# EAGLE design os23dc (EAGLE 7.3.0)
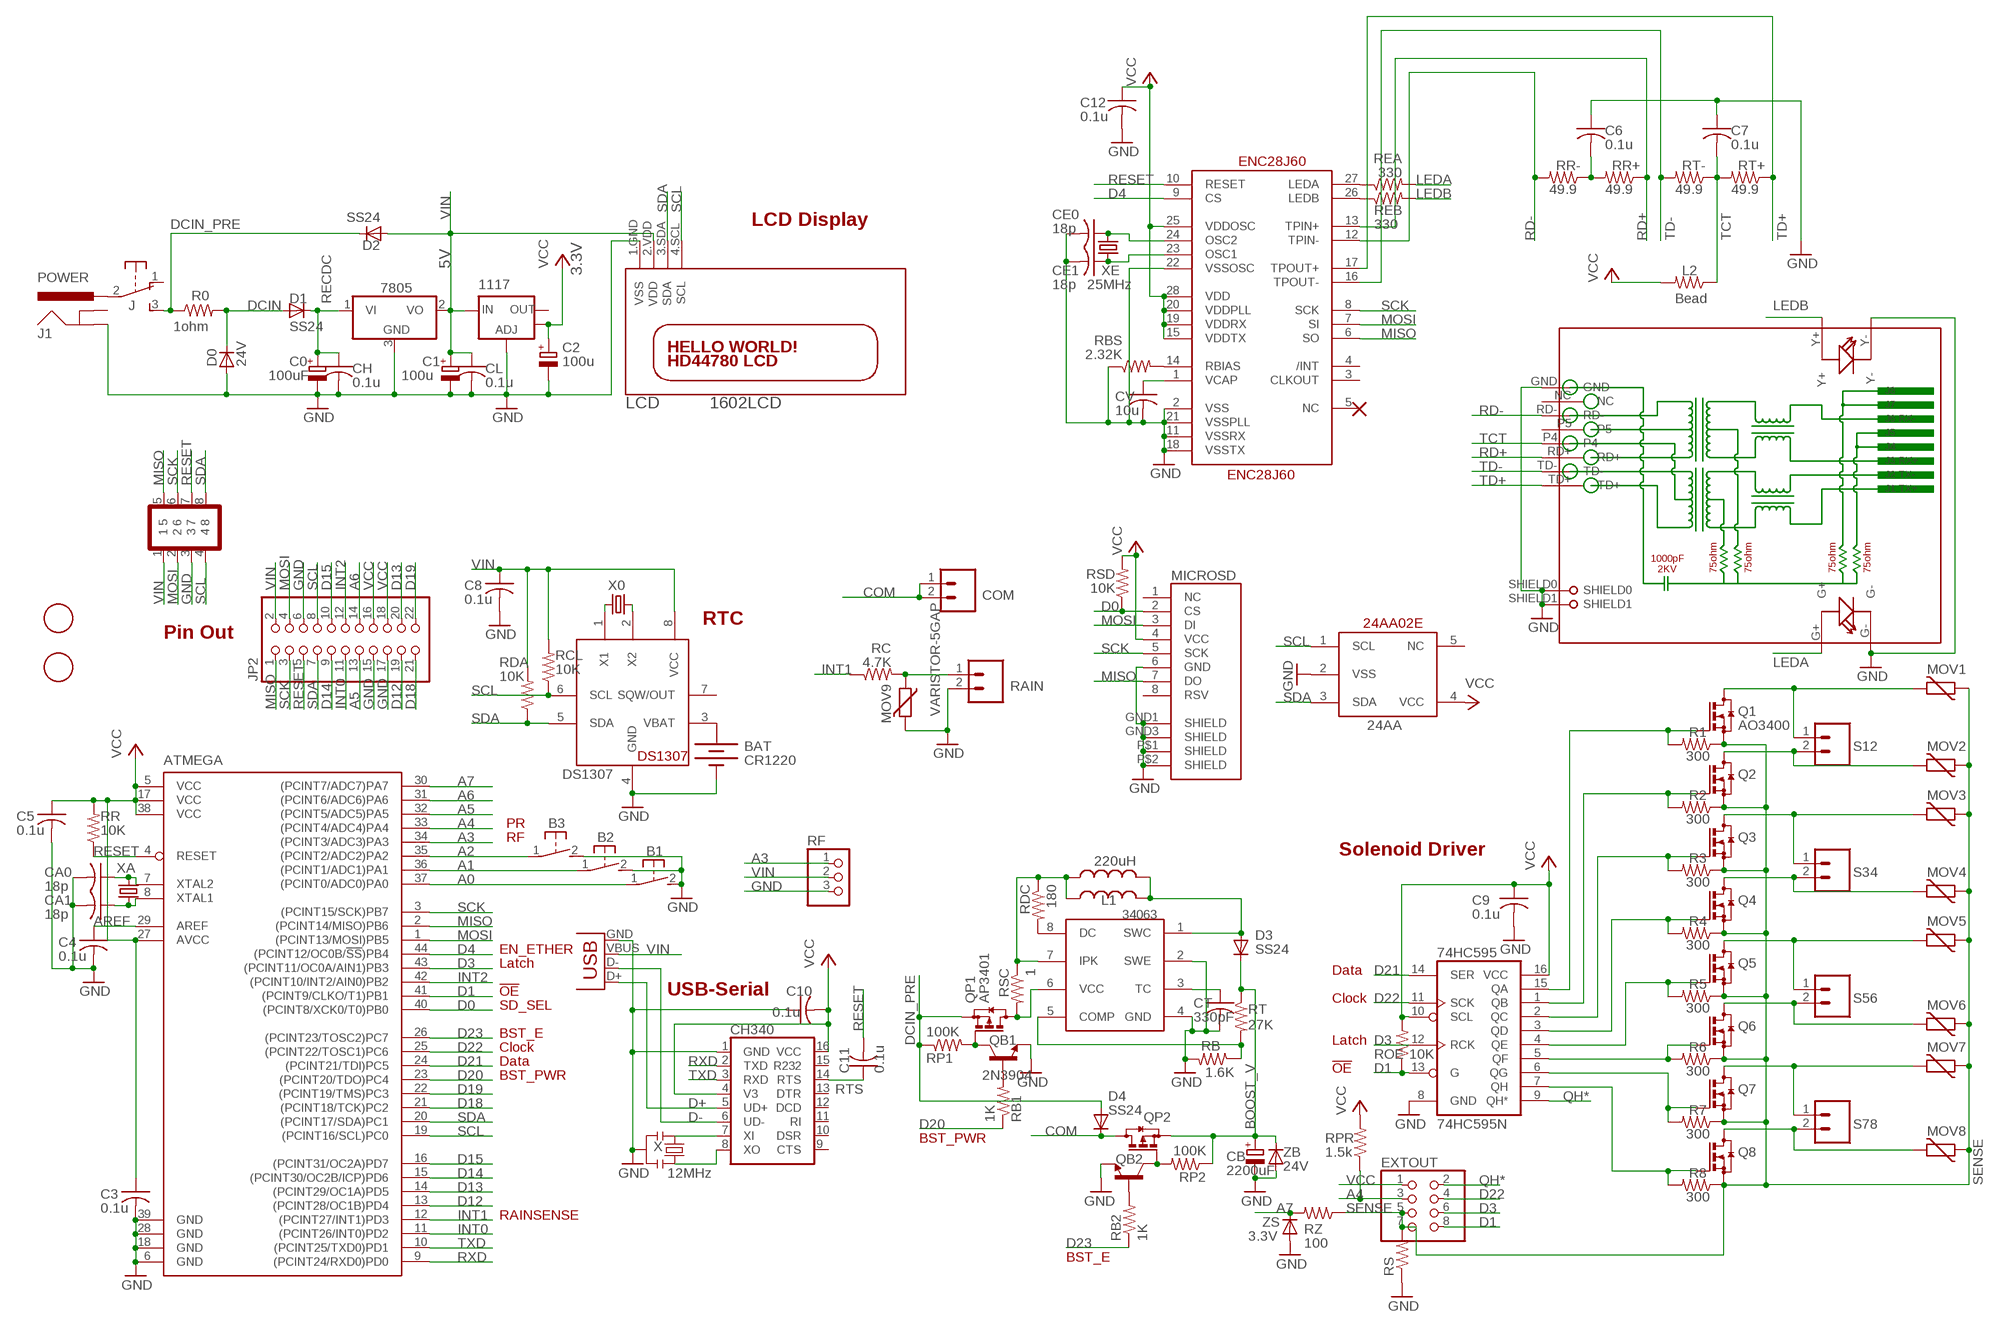
[diagram p0: schematic, sheet 1]

## Parts
24AA  24AA02E48  [SOT23-5L]
74HC595  74HC595N  74LS595D  [SO16]
1117  V_REG_LM1117SOT223  [SOT223]
7805  7805DT  [TO252]
34063  MC33063/MC34063D  [SO08]
ATMEGA  ATMEGA644A  [TQFP44]
B1  31-XX  [B3F-31XX]
B2  31-XX  [B3F-31XX]
B3  31-XX  [B3F-31XX]
BAT  CR1220  BATTERYBATTERY_12MM_SMT  [BATTCON_12MM_SMT]
C0  100uF  CPOL-EUE  [PANASONIC_E]
C1  100u  CPOL-EUD  [PANASONIC_D]
C2  100u  CPOL-EUD  [PANASONIC_D]
C3  0.1u  C-USC0603K  [C0603K]
C4  0.1u  C-USC0603  [C0603]
C5  0.1u  C-USC0603  [C0603]
C6  0.1u  C-USC0603  [C0603]
C7  0.1u  C-USC0603K  [C0603K]
C8  0.1u  C-USC0603  [C0603]
C9  0.1u  C-USC0603  [C0603]
C10  0.1u  C-USC0603  [C0603]
C11  0.1u  C-USC0603  [C0603]
C12  0.1u  C-USC0603  [C0603]
CA0  18p  C-USC0603K  [C0603K]
CA1  18p  C-USC0603K  [C0603K]
CB  2200uF  CPOL-EUE7.5-16  [E7,5-16]
CE0  18p  C-USC0603K  [C0603K]
CE1  18p  C-USC0603K  [C0603K]
CH  0.1u  C-USC0603  [C0603]
CH340  CH340G  [SO16]
CL  0.1u  C-USC0603  [C0603]
COM  M025MM-X  [SCREWTERMINAL-5MM-2-X]
CT  330pF  C-USC0603K  [C0603K]
CV  10u  C-USC0805K  [C0805K]
D0  24V  DIODE-MINIMELF  [MINIMELF]
D1  SS24  DIODE-DO-214AC  [DO-214AC]
D2  SS24  DIODE-DO-214AC  [DO-214AC]
D3  SS24  DIODE-DO-214AC  [DO-214AC]
D4  SS24  DIODE-DO-214AC  [DO-214AC]
DS1307  DS1307  DS1307SOIC  [SO08]
ENC28J60  ENC28J60  [SSOP28DB]
EXTOUT  PINHD-2X4  [2X04]
J  EG1206  [EG1206]
J1  POWER  POWER_JACKPTH_LOCK  [POWER_JACK_PTH_LOCK]
JP2  PINHD-2X11  [2X11]
L1  INDUCTORCR54  [CR54]
L1'  220uH  L-US0204/5  [0204/5]
L2  Bead  R-US_R0805  [R0805]
LCD  1602LCD  HD44780LCD-I2CSIDE  [LCD1602-I2C-SIDE]
MICROSD  USD-SOCKETMICRO-SD-SOCKET-TAOBAO  [MICRO-SD-SOCKET-TAOBAO]
MOV1  7D270K  VARISTOR-5GAP  [R-5GAP]
MOV2  7D270K  VARISTOR-5GAP  [R-5GAP]
MOV3  7D270K  VARISTOR-5GAP  [R-5GAP]
MOV4  7D270K  VARISTOR-5GAP  [R-5GAP]
MOV5  7D270K  VARISTOR-5GAP  [R-5GAP]
MOV6  7D270K  VARISTOR-5GAP  [R-5GAP]
MOV7  7D270K  VARISTOR-5GAP  [R-5GAP]
MOV8  7D270K  VARISTOR-5GAP  [R-5GAP]
MOV9  VARISTOR-5GAP  [R-5GAP]
Q1  AO3400  BSS123  [SOT23]
Q2  BSS123  [SOT23]
Q3  BSS123  [SOT23]
Q4  BSS123  [SOT23]
Q5  BSS123  [SOT23]
Q6  BSS123  [SOT23]
Q7  BSS123  [SOT23]
Q8  BSS123  [SOT23]
QB1  2N3904  TRANSISTOR_NPNSOT23-3  [SOT23-3]
QB2  TRANSISTOR_NPNSOT23-3  [SOT23-3]
QP1  AP3401  BSS84  [SOT23]
QP2  BSS84  [SOT23]
R0  1ohm  R-US_R2010  [R2010]
R1  300  R-US_R0603  [R0603]
R2  300  R-US_R0603  [R0603]
R3  300  R-US_R0603  [R0603]
R4  300  R-US_R0603  [R0603]
R5  300  R-US_R0603  [R0603]
R6  300  R-US_R0603  [R0603]
R7  300  R-US_R0603  [R0603]
R8  300  R-US_R0603  [R0603]
RAIN  M025MM-X  [SCREWTERMINAL-5MM-2-X]
RB  1.6K  R-US_R0603  [R0603]
RB1  1K  R-US_R0603  [R0603]
RB2  1K  R-US_R0603  [R0603]
RBS  2.32K  R-US_R0805  [R0805]
RC  4.7K  R-US_R0805  [R0805]
RCL  10K  R-US_R0603  [R0603]
RDA  10K  R-US_R0603  [R0603]
RDC  180  R-US_R0603  [R0603]
REA  330  R-US_R0603  [R0603]
REB  330  R-US_R0603  [R0603]
RF  PINHD-1X3  [1X03]
RJ45  HR911105A  [HR911105A]
ROE  10K  R-US_R0603  [R0603]
RP1  100K  R-US_R0603  [R0603]
RP2  100K  R-US_R0603  [R0603]
RPR  1.5k  R-US_R0603  [R0603]
RR  10K  R-US_R0603  [R0603]
RR+  49.9  R-US_R0603  [R0603]
RR-  49.9  R-US_R0603  [R0603]
RS  R-US_R2512  [R2512]
RSC  1  R-US_R0603  [R0603]
RSD  10K  R-US_R0603  [R0603]
RT  27K  R-US_R0603  [R0603]
RT+  49.9  R-US_R0603  [R0603]
RT-  49.9  R-US_R0603  [R0603]
RZ  100  R-US_R0402  [R0402]
S12  M025MM-X  [SCREWTERMINAL-5MM-2-X]
S34  M025MM-X  [SCREWTERMINAL-5MM-2-X]
S56  M025MM-X  [SCREWTERMINAL-5MM-2-X]
S78  M025MM-X  [SCREWTERMINAL-5MM-2-X]
U$1  FIDUCIAL  [FIDUCIAL_1MM]
U$3  FIDUCIAL  [FIDUCIAL_1MM]
U$4  GOLDFINGER_2X4  [GOLDFINGER_2X4]
USB  USBPTH  [USB-B-PTH]
X  12MHz  RESONATORSMD  [RESONATOR-SMD]
X0  32.768kHz  CRYSTALMM20SS  [MM20SS]
XA  12MHz  CRYSTAL4SMD  [4SMD]
XE  25MHz  CRYSTAL4SMD  [4SMD]
ZB  24V  DIODE-MINIMELF  [MINIMELF]
ZS  3.3V  DIODE-MINIMELF  [MINIMELF]

## Nets
A0: ATMEGA.37((PCINT0/ADC0)PA0) B1.1(P)
A1: ATMEGA.36((PCINT1/ADC1)PA1) B2.1(P)
A2: ATMEGA.35((PCINT2/ADC2)PA2) B3.1(P)
A3: ATMEGA.34((PCINT3/ADC3)PA3) RF.1
A4: ATMEGA.33((PCINT4/ADC4)PA4) EXTOUT.3 RPR.1
A5: ATMEGA.32((PCINT5/ADC5)PA5) JP2.13
A6: ATMEGA.31((PCINT6/ADC6)PA6) JP2.14
A7: ATMEGA.30((PCINT7/ADC7)PA7) RZ.2 ZS.C
AREF: ATMEGA.29(AREF) C4.1
BOOST_V: CB.+ D3.C QP2.2(S) RP2.1 RT.1 ZB.C
COM: COM.1 COM.2 D4.C QP2.3(D)
D0: ATMEGA.40((PCINT8/XCK0/T0)PB0) MICROSD.2(CS) RSD.1
D1: 74HC595.13(G) ATMEGA.41((PCINT9/CLKO/T1)PB1) EXTOUT.8 ROE.1
D3: 74HC595.12(RCK) ATMEGA.43((PCINT11/OC0A/AIN1)PB3) EXTOUT.6
D4: ATMEGA.44((PCINT12/OC0B/!SS!)PB4) ENC28J60.9(CS)
D12: ATMEGA.13((PCINT28/OC1B)PD4) JP2.19
D13: ATMEGA.14((PCINT29/OC1A)PD5) JP2.20
D14: ATMEGA.15((PCINT30/OC2B/ICP)PD6) JP2.9
D15: ATMEGA.16((PCINT31/OC2A)PD7) JP2.10
D18: ATMEGA.21((PCINT18/TCK)PC2) JP2.21
D19: ATMEGA.22((PCINT19/TMS)PC3) JP2.22
D20: ATMEGA.23((PCINT20/TDO)PC4) RB1.1
D21: 74HC595.14(SER) ATMEGA.24((PCINT21/TDI)PC5)
D22: 74HC595.11(SCK) ATMEGA.25((PCINT22/TOSC1)PC6) EXTOUT.4
D23: ATMEGA.26((PCINT23/TOSC2)PC7) RB2.1
D+: CH340.5(UD+) USB.D+
D-: CH340.6(UD-) USB.D-
DCIN [power]: D0.C D1.A R0.2
DCIN_PRE [power]: D2.C D4.A J.3(S) QP1.2(S) R0.1 RP1.1
GND: 24AA.2(VSS) 74HC595.8(GND) 1117.1(ADJ) 7805.3(GND) 34063.2(SWE) 34063.4(GND) ATMEGA.6(GND) ATMEGA.18(GND) ATMEGA.28(GND) ATMEGA.39(GND) B1.2(S) B2.2(S) B3.2(S) BAT.P$1(-) C0.- C1.- C2.- C3.2 C4.2 C5.2 C6.1 C7.1 C8.2 C9.2 C10.1 C12.2 CA0.2 CA1.2 CB.- CE0.2 CE1.2 CH340.1(GND) CH.2 CL.2 CT.2 CV.2 D0.A DS1307.4(GND) ENC28J60.2(VSS) ENC28J60.11(VSSRX) ENC28J60.18(VSSTX) ENC28J60.21(VSSPLL) ENC28J60.22(VSSOSC) J1.GND JP2.6 JP2.15 JP2.17 LCD.1.GND(VSS) MICROSD.6(GND) MICROSD.GND1(SHIELD) MICROSD.GND3(SHIELD) MICROSD.P$1(SHIELD) MICROSD.P$2(SHIELD) MOV9.2 QB1.2(E) QB2.2(E) RAIN.2 RB.2 RBS.1 RF.3 RJ45.G- RJ45.GND RJ45.SHIELD0 RJ45.SHIELD1 RJ45.Y- RS.1 U$4.3 USB.GND X.2 ZB.A ZS.A
INT0: ATMEGA.11((PCINT26/INT0)PD2) JP2.11
INT1: ATMEGA.12((PCINT27/INT1)PD3) RC.1
INT2: ATMEGA.42((PCINT10/INT2/AIN0)PB2) JP2.12
LEDA: REA.2 RJ45.G+
LEDB: REB.2 RJ45.Y+
MISO: ATMEGA.2((PCINT14/MISO)PB6) ENC28J60.6(SO) JP2.1 MICROSD.7(DO) U$4.5
MOSI: ATMEGA.1((PCINT13/MOSI)PB5) ENC28J60.7(SI) JP2.4 MICROSD.3(DI) U$4.2
N$1: J1.PWR J.2(P)
N$2: QB1.3(C) QP1.1(G) RP1.2
N$3: MOV9.1 RAIN.1 RC.2
N$4: 74HC595.5(QF) Q6.1(G) R6.2
N$5: 74HC595.6(QG) Q7.1(G) R7.2
N$6: CH340.7(XI) X.1
N$7: 74HC595.7(QH) Q8.1(G) R8.2
N$8: DS1307.1(X1) X0.1
N$9: 34063.1(SWC) D3.A L1'.2 L1.P$2
N$10: 74HC595.4(QE) Q5.1(G) R5.2
N$11: 74HC595.3(QD) Q4.1(G) R4.2
N$12: 74HC595.2(QC) Q3.1(G) R3.2
N$13: 74HC595.1(QB) Q2.1(G) R2.2
N$14: 74HC595.15(QA) Q1.1(G) R1.2
N$15: ATMEGA.7(XTAL2) CA0.1 XA.1
N$16 [power]: MOV1.2 Q1.3(D) S12.1
N$17 [power]: MOV2.2 Q2.3(D) S12.2
N$18 [power]: MOV3.2 Q3.3(D) S34.1
N$19: ATMEGA.8(XTAL1) CA1.1 XA.3
N$20 [power]: MOV4.2 Q4.3(D) S34.2
N$22 [power]: MOV5.2 Q5.3(D) S56.1
N$23 [power]: MOV6.2 Q6.3(D) S56.2
N$24 [power]: MOV7.2 Q7.3(D) S78.1
N$25 [power]: MOV8.2 Q8.3(D) S78.2
N$26: 34063.7(IPK) L1'.1 L1.P$1 RDC.1 RSC.1
N$27: 34063.6(VCC) QP1.3(D) RSC.2
N$28: 34063.3(TC) CT.1
N$29: 34063.5(COMP) RB.1 RT.2
N$30: DS1307.2(X2) X0.4
N$31: 34063.8(DC) RDC.2
N$32: QB1.1(B) RB1.2
N$34: ENC28J60.27(LEDA) REA.1
N$36: BAT.P$2(+) DS1307.3(VBAT)
N$37: ENC28J60.26(LEDB) REB.1
N$38: QB2.3(C) QP2.1(G) RP2.2
N$39: CV.1 ENC28J60.1(VCAP)
N$40: CH340.8(XO) X.3
N$41: CE0.1 ENC28J60.24(OSC2) XE.3
N$42: CE1.1 ENC28J60.23(OSC1) XE.1
N$43: QB2.1(B) RB2.2
N$54: C6.2 RR+.2 RR-.1
N$59: ENC28J60.14(RBIAS) RBS.2
QH*: 74HC595.9(QH*) EXTOUT.2
RD+: ENC28J60.13(TPIN+) RJ45.RD+ RR+.1
RD-: ENC28J60.12(TPIN-) RJ45.RD- RR-.2
RECDC [power]: 7805.1(VI) C0.+ CH.1 D1.C
RESET: ATMEGA.4(RESET) C11.2 ENC28J60.10(RESET) JP2.5 RR.1 U$4.7
RTS: C11.1 CH340.14(RTS)
RXD: ATMEGA.9((PCINT24/RXD0)PD0) CH340.2(TXD)
SCK: ATMEGA.3((PCINT15/SCK)PB7) ENC28J60.8(SCK) JP2.3 MICROSD.5(SCK) U$4.6
SCL: 24AA.1(SCL) ATMEGA.19((PCINT16/SCL)PC0) DS1307.6(SCL) JP2.8 LCD.4.SCL(SCL) RCL.1 U$4.4
SDA: 24AA.3(SDA) ATMEGA.20((PCINT17/SDA)PC1) DS1307.5(SDA) JP2.7 LCD.3.SDA(SDA) RDA.1 U$4.8
SENSE [power]: EXTOUT.5 EXTOUT.7 MOV1.1 MOV2.1 MOV3.1 MOV4.1 MOV5.1 MOV6.1 MOV7.1 MOV8.1 Q1.2(S) Q2.2(S) Q3.2(S) Q4.2(S) Q5.2(S) Q6.2(S) Q7.2(S) Q8.2(S) R1.1 R2.1 R3.1 R4.1 R5.1 R6.1 R7.1 R8.1 RS.2 RZ.1
TCT: C7.2 L2.1 RJ45.P4 RT+.2 RT-.1
TD+: ENC28J60.17(TPOUT+) RJ45.TD+ RT+.1
TD-: ENC28J60.16(TPOUT-) RJ45.TD- RT-.2
TXD: ATMEGA.10((PCINT25/TXD0)PD1) CH340.3(RXD)
VCC: 24AA.4(VCC) 74HC595.10(SCL) 74HC595.16(VCC) 1117.4(OUT) ATMEGA.5(VCC) ATMEGA.17(VCC) ATMEGA.27(AVCC) ATMEGA.38(VCC) C2.+ C3.1 C5.1 C9.1 C10.2 C12.1 CH340.4(V3) CH340.16(VCC) ENC28J60.15(VDDTX) ENC28J60.19(VDDRX) ENC28J60.20(VDDPLL) ENC28J60.25(VDDOSC) ENC28J60.28(VDD) EXTOUT.1 JP2.16 JP2.18 L2.2 MICROSD.4(VCC) ROE.2 RPR.2 RR.2 RSD.2
VIN [power]: 1117.3(IN) 7805.2(VO) C1.+ C8.1 CL.1 D2.A DS1307.8(VCC) JP2.2 LCD.2.VDD(VDD) RCL.2 RDA.2 RF.2 U$4.1 USB.VBUS
Unconnected: 24AA.5(NC) 1117.2(OUT) CH340.9(CTS) CH340.10(DSR) CH340.11(RI) CH340.12(DCD) CH340.13(DTR) CH340.15(R232) DS1307.7(SQW/OUT) ENC28J60.3(CLKOUT) ENC28J60.4(/INT) ENC28J60.5(NC) J1.GNDBREAK J.1(O) MICROSD.1(NC) MICROSD.8(RSV) RJ45.NC RJ45.P5

## Notes on the sheet
- LCD Display
- 5V
- 3.3V
- RTC
- Pin Out
- PR
- RF
- Solenoid Driver
- EN_ETHER
- Latch
- Data
- !OE | USB-Serial
- Clock
- SD_SEL
- BST_E
- Latch
- Clock
- Data
- !OE
- BST_PWR
- BST_PWR
- RAINSENSE
- BST_E

## Library data of the parts
24AA = adafruit:24AA02E48
74HC595 = SparkFun:74*595: 8-bit SHIFT REGISTER, output latch
1117 = SparkFun:V_REG_LM1117: Voltage Regulator LM1117 Standard adjustable voltage regulator but in SMD form. Spark Fun Electronics SKU : COM-00595
7805 = linear:78*: Positive VOLTAGE REGULATOR Source: http://cache.national.com/ds/LM/LM78L05.pdf http://www.fairchildsemi.com/ds/LM/LM7805.pdf
34063 = adafruit:MC33063/MC34063: MC33063 and MC34063 Basic DC/DC converter with internal power-NPN transistor, 100KHz, 1.5A peak switch current. 3-40 input/output.
ATMEGA = atmel:ATMEGA644: 8-bit Microcontroller with 64K Bytes In-System Programmable Flash Source: http://www.atmel.com/dyn/resources/prod_documents/doc2593.pdf; MPN: ATMEGA644PV-10AU; OC_FARNELL: 1455123; OC_NEWARK: 58M3748
B1-B3 = adafruit:31-XX: OMRON SWITCH Now with beefier pads!
BAT = SparkFunNew:BATTERY: Battery Holders Various common sizes : AA, AAA, 20mm coin cell and 12mm coin cell.
C0 C1 C2 = resistor:CPOL-EU: POLARIZED CAPACITOR, European symbol
C3-C12 CA0 CA1 CE0 CE1 CH CL CT CV = adafruit:C-US: CAPACITOR, American symbol
CB = rcl:CPOL-EU: POLARIZED CAPACITOR, European symbol
CH340 = SparkFunNew:CH340
COM RAIN S12 S34 S56 S78 = SparkFun:M02: Header 2 Standard 2-pin 0.1" header. Use with straight break away headers (SKU : PRT-00116), right angle break away headers (PRT-00553), swiss pins (PRT-00743), machine pins (PRT-00117), and female headers (PRT-00115). Molex polarized connector foot print use with SKU : PRT-08233 with associated crimp pins and housings.
D0 D1-D4 ZB ZS = diode:DIODE-: DIODE
DS1307 = adafruit:DS1307: DS1307 Real time clock (RTC) with battery backup ability. Talk to it via i2c
ENC28J60 = SparkFun:ENC28J60
EXTOUT = pinhead:PINHD-2X4: PIN HEADER
J = adafruit:EG1206
J1 = SparkFunNew:POWER_JACK: Power Jack This is the standard 5.5mm barrel jack for power. The PTH is the most common, proven, reliable, footprint. All others are experimental. The Slot footprint only works if the mill layer is transmitted to the PCB fab house so be warned. Spark Fun Electronics SKU : PRT-00119. Mating wall wart : TOL-00298 (and others)
JP2 = pinhead:PINHD-2X11: PIN HEADER
L1 = SparkFunNew:INDUCTOR: Inductors Basic Inductor/Choke - 0603 and 1206. Footprints are not proven and vary greatly between part numbers.
L1' = rcl:L-US: INDUCTOR, American symbol
L2 R1-R8 RC RCL RDA ROE RPR RR RS RSD = adafruit2013:R-US_: RESISTOR, American symbol
LCD = adafruit:HD44780LCD-I2C
MICROSD = SparkFunNew:USD-SOCKET: microSD Socket Push-push type uSD socket. Schematic element and footprint production proven. Spark Fun Electronics SKU : PRT-00127. tDoc lines correctly indicate media card edge positions when inserting (unlocked, locked, depressed).
MOV1-MOV9 = varistor:VARISTOR: VARISTOR
Q1-Q8 = transistor-small-signal:BSS123: N-CHANNEL MOS FET
QB1 QB2 = SparkFunNew:TRANSISTOR_NPN: Transistor NPN BJT configuration in SOT23 package. MMBT2222 is the common NPN we use. Double check BCE configuration again layout.
QP1 QP2 = transistor-small-signal:BSS84: P-CHANNEL MOS FET
R0 RB RB1 RB2 RBS RDC REA REB RP1 RP2 RR+ RR- RSC RT RT+ RT- RZ = adafruitGood:R-US_: RESISTOR, American symbol
RF = pinhead:PINHD-1X3: PIN HEADER
RJ45 = CONNECTER:HR911105A
U$1 U$3 = adafruitGood:FIDUCIAL: For use by pick and place machines to calibrate the vision/machine, 1mm By microbuilder.eu
U$4 = SparkFunNew:GOLDFINGER_2X4
USB = SparkFunNew:USB: USB Connectors USB-B-PTH is fully proven SKU : PRT-00139 USB-miniB is fully proven SKU : PRT-00587 USB-A-PCB is untested. USB-A-H is throughly reviewed, but untested. Spark Fun Electronics SKU : PRT-00437 USB-B-SMT is throughly reviewed, but untested. Needs silkscreen touching up. USB-A-S has not been used/tested USB-MB-H has not been used/tested
X = SparkFunNew:RESONATOR: Resonator Small SMD resonator. This is the itty bitty 10/20MHz resonators with built in caps. CSTCE10M0G55 and CSTCE20M0V53. Footprint has been reviewed closely but hasn't been tested yet.
X0 = crystal:CRYSTAL: CRYSTAL; OC_FARNELL: unknown; OC_NEWARK: unknown
XA XE = adafruit_3:CRYSTAL: CRYSTAL

## Net classes
0 default: width 0.203 mm, clearance 0.178 mm
1 power: width 0.305 mm, clearance 0.178 mm
2 relaypower: width 0.813 mm, clearance 0.305 mm

## Board
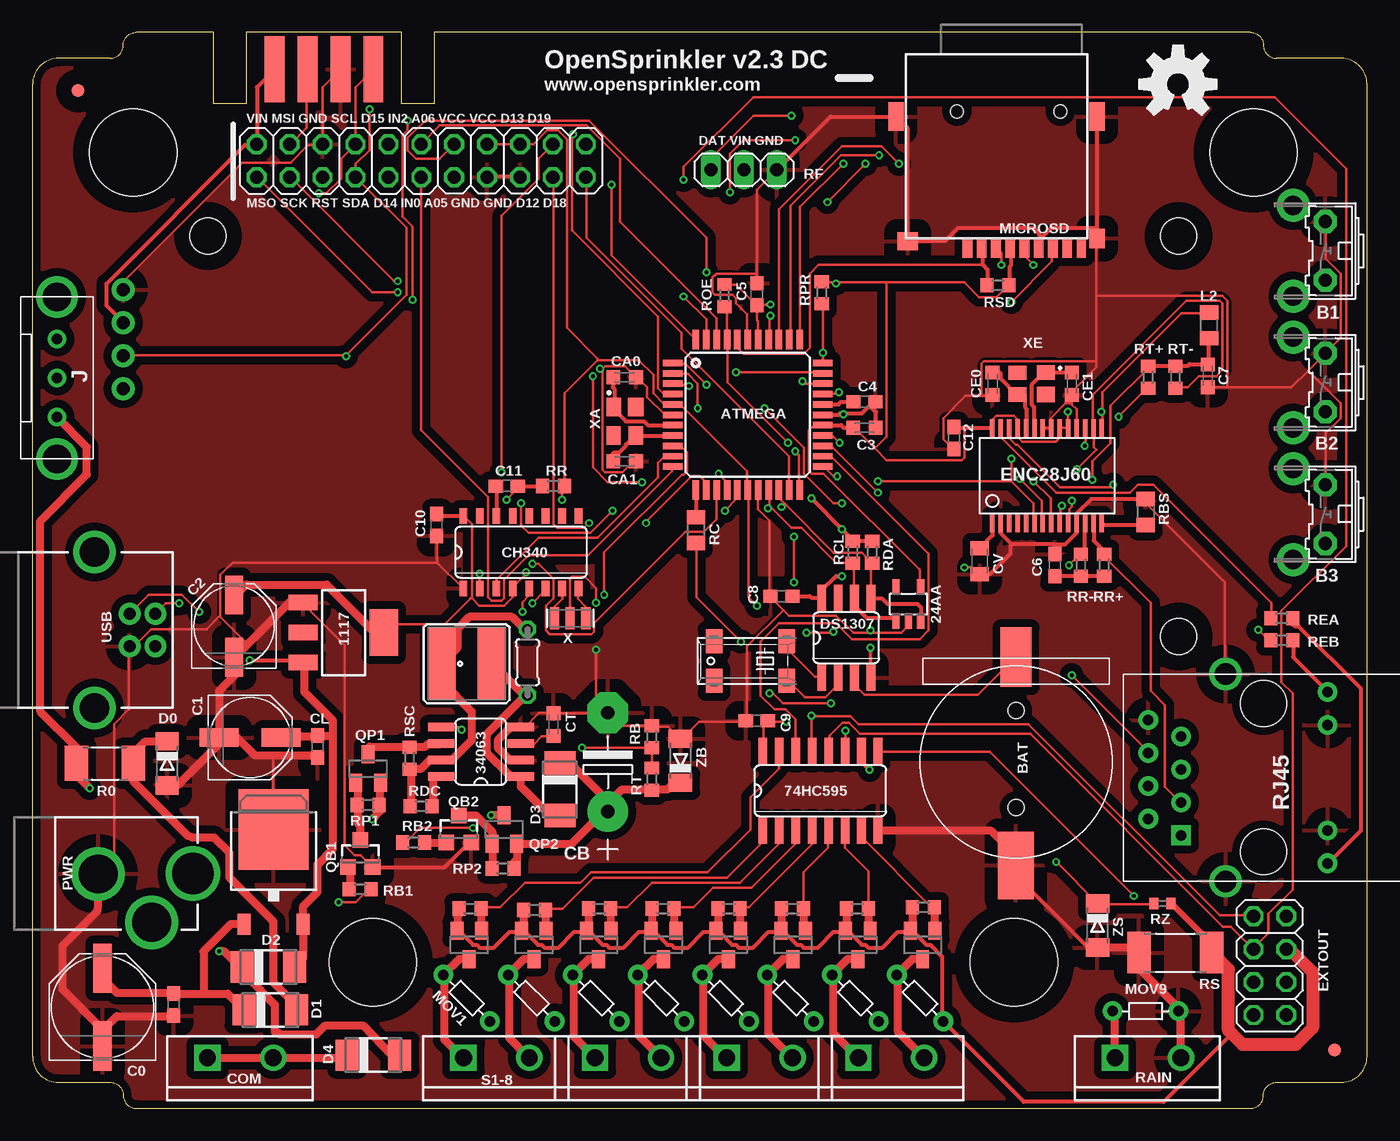
[diagram p1: board, top side]
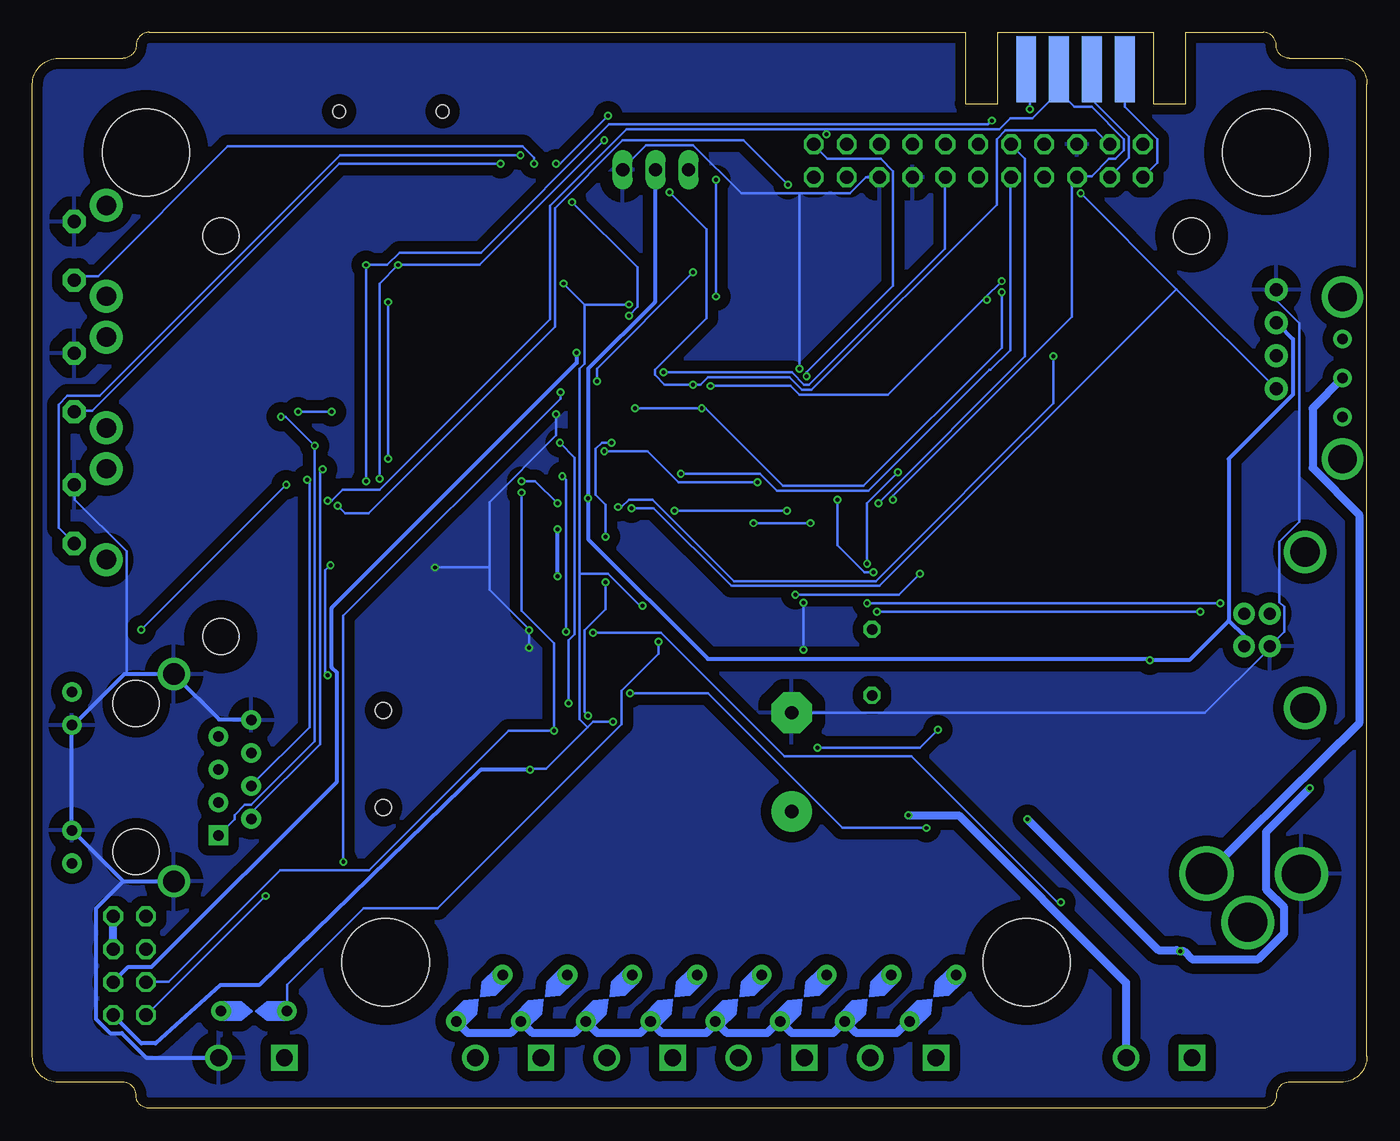
[diagram p2: board, bottom side, seen from below]

Size 103 x 83 mm. Coordinates in mm from the lower left corner, seen from the top.
Outline: 101,81 96,81 arc-90 95,82 arc90 94,83 31,83 31,77.5 28.5,77.5 28.5,83 16.5,83 16.5,77.5 14,77.5 14,83 8,83 arc90 7,82 arc-90 6,81 2,81 arc90 0,79 0,4 arc90 2,2 6,2 arc-90 7,1 arc90 8,0 94,0 arc90 95,1 arc-90 96,2 101,2 arc90 103,4 103,79 arc90 101,81
Copper layers (1*16): Top 0.035mm / dielectric 1.5mm / Bottom 0.035mm
Design rules "Fusion_eagle_rule_v1.1 *": minimum track width 6mil, minimum drill 12mil, track to track 6mil, track to pad 6mil, pad to pad 6mil, via to via 6mil, smd to smd 0mil, copper to edge 10mil, drill to drill 10mil, minimum pad ring 10mil, minimum via ring 6mil, stop-mask expansion 2mil, vias tented up to drill 100mil, thermal gap 40mil
Holes 6.75 mm at 7.76,73.74 94.24,73.74 26.26,11.26 75.74,11.26
tRestrict: area 3.8,69.7 to 11.8,77.7; area 90.2,69.7 to 98.2,77.7; area 22.3,7.3 to 30.3,15.3; area 71.7,7.3 to 79.7,15.3
bRestrict: area 3.8,69.7 to 11.8,77.7; area 90.2,69.7 to 98.2,77.7; area 22.3,7.3 to 30.3,15.3; area 71.7,7.3 to 79.7,15.3

### Footprints (pad centres in the part's own frame; a part is rotated, then mirrored left to right if it is on the bottom)
SOT23-5L = smd 0.55 x 1.2: 1 -0.95,-1.3; 2 0,-1.3; 3 0.95,-1.3; 4 0.95,1.3; 5 -0.95,1.3
SO16 = smd 0.66 x 2.032: 1 -4.445,-3.073; 2 -3.175,-3.073; 3 -1.905,-3.073; 4 -0.635,-3.073; 5 0.635,-3.073; 6 1.905,-3.073; 7 3.175,-3.073; 8 4.445,-3.073; 9 4.445,3.073; 10 3.175,3.073; 11 1.905,3.073; 12 0.635,3.073; 13 -0.635,3.073; 14 -1.905,3.073; 15 -3.175,3.073; 16 -4.445,3.073
SOT223 = smd 1.219 x 2.235: 1 -2.311,-3.099; 2 0,-3.099; 3 2.311,-3.099 | smd 3.6 x 2.2: 4 0,3.099
TO252 = smd 1 x 1.6: 1 -2.28,-4.8; 2 2.28,-4.8 | smd 5.4 x 6.2: 3 0,2.5
SO08 = smd 0.66 x 2.032: 1 -1.905,-3.073; 2 -0.635,-3.073; 3 0.635,-3.073; 4 1.905,-3.073; 5 1.905,3.073; 6 0.635,3.073; 7 -0.635,3.073; 8 -1.905,3.073
TQFP44 = smd 1.5 x 0.5: 1 -5.8,4; 2 -5.8,3.2; 3 -5.8,2.4; 4 -5.8,1.6; 5 -5.8,0.8; 6 -5.8,0; 7 -5.8,-0.8; 8 -5.8,-1.6; 9 -5.8,-2.4; 10 -5.8,-3.2; 11 -5.8,-4; 23 5.8,-4; 24 5.8,-3.2; 25 5.8,-2.4; 26 5.8,-1.6; 27 5.8,-0.8; 28 5.8,0; 29 5.8,0.8; 30 5.8,1.6; 31 5.8,2.4; 32 5.8,3.2; 33 5.8,4 | smd 0.5 x 1.5: 12 -4,-5.8; 13 -3.2,-5.8; 14 -2.4,-5.8; 15 -1.6,-5.8; 16 -0.8,-5.8; 17 0,-5.8; 18 0.8,-5.8; 19 1.6,-5.8; 20 2.4,-5.8; 21 3.2,-5.8; 22 4,-5.8; 34 4,5.8; 35 3.2,5.8; 36 2.4,5.8; 37 1.6,5.8; 38 0.8,5.8; 39 0,5.8; 40 -0.8,5.8; 41 -1.6,5.8; 42 -2.4,5.8; 43 -3.2,5.8; 44 -4,5.8
B3F-31XX = drill 1.016 pad 1.778 octagon: 1 -2.261,-1.245; 2 2.261,-1.245 | drill 1.499 pad 2.54: 3 -3.505,1.245; 4 3.505,1.245
BATTCON_12MM_SMT = smd 2.8 x 5.2: P$1 0,11.96 | smd 2.4 x 4.6: P$2 0,-4.1 | hole 1.25: 0,7.5; 0,0
PANASONIC_E = smd 3.8 x 1.4: + 3,0; - -3,0
PANASONIC_D = smd 3 x 1.4: + 2.4,0; - -2.4,0
C0603K = smd 1.05 x 1.08: 1 -0.875,0; 2 0.875,0
C0603 = smd 1.1 x 1: 1 -0.85,0; 2 0.85,0
E7,5-16 = drill 1.016 pad 3.15: + -3.81,0 | drill 1.016 pad 3.15 octagon: - 3.81,0
SO16' = smd 0.6 x 1.2: 1 -4.445,-2.8; 2 -3.175,-2.8; 3 -1.905,-2.8; 4 -0.635,-2.8; 5 0.635,-2.8; 6 1.905,-2.8; 7 3.175,-2.8; 8 4.445,-2.8; 9 4.445,2.8; 10 3.175,2.8; 11 1.905,2.8; 12 0.635,2.8; 13 -0.635,2.8; 14 -1.905,2.8; 15 -3.175,2.8; 16 -4.445,2.8
SCREWTERMINAL-5MM-2-X = drill 1.3 pad 2.032 square: 1 0,0 | drill 1.3 pad 2.032: 2 5.08,0
C0805K = smd 1.1 x 1.4: 1 -1,0; 2 1,0
MINIMELF = smd 1.4 x 1.8: A 1.7,0; C -1.7,0
DO-214AC = smd 1.8 x 2.4: A 2.025,0; C -2.025,0
SSOP28DB = smd 0.348 x 1.397: 1 -4.225,-3.656; 2 -3.575,-3.656; 3 -2.925,-3.656; 4 -2.275,-3.656; 5 -1.625,-3.656; 6 -0.975,-3.656; 7 -0.325,-3.656; 8 0.325,-3.656; 9 0.975,-3.656; 10 1.625,-3.656; 11 2.275,-3.656; 12 2.925,-3.656; 13 3.575,-3.656; 14 4.225,-3.656; 15 4.225,3.656; 16 3.575,3.656; 17 2.925,3.656; 18 2.275,3.656; 19 1.625,3.656; 20 0.975,3.656; 21 0.325,3.656; 22 -0.325,3.656; 23 -0.975,3.656; 24 -1.625,3.656; 25 -2.275,3.656; 26 -2.925,3.656; 27 -3.575,3.656; 28 -4.225,3.656
2X04 = drill 1.016 octagon: 1 -3.81,-1.27; 2 -3.81,1.27; 3 -1.27,-1.27; 4 -1.27,1.27; 5 1.27,-1.27; 6 1.27,1.27; 7 3.81,-1.27; 8 3.81,1.27
EG1206 = drill 0.8 pad 1.422: 1 -3,0; 2 0,0; 3 3,0 | drill 2.2: MT1 -6.25,0; MT2 6.25,0
POWER_JACK_PTH_LOCK = drill 2.997 pad 4.115: GND 0.025,6.557; GNDBREAK 3.762,10.7 | drill 3.2 pad 4.115: PWR 0,13.878
2X11 = drill 1.016 octagon: 1 -12.7,-1.27; 2 -12.7,1.27; 3 -10.16,-1.27; 4 -10.16,1.27; 5 -7.62,-1.27; 6 -7.62,1.27; 7 -5.08,-1.27; 8 -5.08,1.27; 9 -2.54,-1.27; 10 -2.54,1.27; 11 0,-1.27; 12 0,1.27; 13 2.54,-1.27; 14 2.54,1.27; 15 5.08,-1.27; 16 5.08,1.27; 17 7.62,-1.27; 18 7.62,1.27; 19 10.16,-1.27; 20 10.16,1.27; 21 12.7,-1.27; 22 12.7,1.27
CR54 = smd 5.5 x 2.15: P$1 0,1.92; P$2 0,-1.92
0204/5 = drill 0.813 octagon: 1 -2.54,0; 2 2.54,0
R0805 = smd 1.1 x 1.4: 1 -1,0; 2 1,0
LCD1602-I2C-SIDE = drill 1 pad 1.778: 1.GND -4,29.3; 2.VDD -4,26.76; 3.SDA -4,24.22; 4.SCL -4,21.68 | hole 2.8: 2.54,33.46; 77.46,33.46; 77.46,2.54
MICRO-SD-SOCKET-TAOBAO = smd 0.75 x 1.6: 1 2.25,10.5; 2 1.15,10.5; 3 0.05,10.5; 4 -1.05,10.5; 5 -2.15,10.5; 6 -3.25,10.5; 7 -4.35,10.5; 8 -5.45,10.5 | smd 0.7 x 1.6: CD -6.55,10.5 | smd 1.2 x 1.5: GND1 -7.75,9.8 | smd 1.6 x 1.4: GND3 6.85,10 | smd 1.2 x 2.2: P$1 7.75,0.4; P$2 -7.75,0.4 | hole 1: 3.05,0; -4.93,0
R-5GAP = drill 0.813 pad 1.524: 1 -2.54,0; 2 2.54,0
SOT23 = smd 1 x 1.4: 1 -0.95,-1.1; 2 0.95,-1.1; 3 0,1.1
SOT23-3 = smd 1.2 x 1.2: 1 -0.95,-1; 2 0.95,-1; 3 0,1.1
R2010 = smd 1.8 x 2.7: 1 -2.2,0; 2 2.2,0
R0603 = smd 1 x 1.1: 1 -0.85,0; 2 0.85,0
1X03 = drill 1.016 long: 1 -2.54,0; 2 0,0; 3 2.54,0
HR911105A = drill 0.813 pad 1.524: G+ 4.953,-6.604; G- 4.953,-4.064; GND -8.89,4.445; NC -6.35,3.175; P4 -8.89,-0.635; P5 -6.35,0.635; RD+ -6.35,-1.905; RD- -8.89,1.905; TD- -8.89,-3.175; Y+ 4.953,6.604; Y- 4.953,4.064 | drill 1.651 pad 2.159: SHIELD0 -2.921,8.001; SHIELD1 -2.921,-8.001 | drill 0.813 pad 1.524 square: TD+ -6.35,-4.445 | hole 3.556: 0,-5.715; 0,5.715
R2512 = smd 1.8 x 3.2: 1 -2.8,0; 2 2.8,0
R0402 = smd 0.7 x 0.9: 1 -0.65,0; 2 0.65,0
FIDUCIAL_1MM = smd 1 x 1: 1 0,0
GOLDFINGER_2X4 = smd 1.524 x 5.08: 1 -3.81,-2.54; 2 -1.27,-2.54; 3 1.27,-2.54; 4 3.81,-2.54 | smd 1.524 x 5.08 bottom: 5 -3.81,-2.54; 6 -1.27,-2.54; 7 1.27,-2.54; 8 3.81,-2.54
USB-B-PTH = drill 0.914 pad 1.676: D+ 0,1.25; D- 1.981,1.25; GND 0,-1.25; VBUS 1.981,-1.25 | drill 2.286: S1 -2.718,-6.02; S2 -2.718,6.02
RESONATOR-SMD = smd 0.7 x 1.7: 1 -1.2,0; 2 0,0; 3 1.2,0
MM20SS = smd 1.27 x 1.88: 1 -2.794,-1.524; 2 2.794,-1.524; 3 2.794,1.524; 4 -2.794,1.524
4SMD = smd 1.4 x 1.12: 1 -1.1,-0.85; 3 1.1,0.85 | smd 1.4 x 1.1: 2 1.1,-0.85 | smd 1.4 x 1.2: 4 -1.1,0.85

### Placement (x,y rotation side)
24AA  67.6,38.9 0 top
74HC595  60.8,24.5 0 top
1117  24,36.7 270 top
7805  18.6,19 0 top
34063  34.6,27.5 90 top
ATMEGA  55.2,53.5 0 top
B1  98.54,66.15 90 top
B2  98.54,55.99 90 top
B3  98.54,45.83 90 top
BAT  75.9,30.7 180 top
C0  5.4,7.8 90 top
C1  16.8,28.6 0 top
C2  15.55,37.2 90 top
C3  64.2,52.5 0 top
C4  64.2,54.5 0 top
C5  55.9,62.8 90 top
C6  78.9,41.9 270 top
C7  90.7,56.5 90 top
C8  57.8,39.5 180 top
C9  55.9,29.9 180 top
C10  31.2,45 90 top
C11  36.6,48 0 top
C12  71.1,51.7 270 top
CA0  45.7,56.4 0 top
CA1  45.7,49.9 0 top
CB  44.4,26.7 90 top
CE0  74.1,55.9 270 top
CE1  80.2,55.9 270 top
CH  10.9,8 270 top
CH340  [SO16']  37.7,42.9 0 top
CL  22,27.9 270 top
COM  13.5,3.9 0 top
CT  40.2,29.6 90 top
CV  73.1,42.2 270 top
D0  10.4,26.6 270 top
D1  18.35,7.58 0 top
D2  18.2,10.9 0 top
D3  40.7,24.6 270 top
D4  26.3,4.1 0 top
DS1307  62.8,36.3 0 top
ENC28J60  78.3,48.8 0 top
EXTOUT  95.5,11 90 top
J  1.9,56.34 270 top
J1  -1.5,18.1 270 top
JP2  30,73.1 0 top
L1  33.5,34.3 90 top
L1'  38.2,34.4 270 top
L2  90.8,60.4 90 top
LCD  11,33.84 0 top
MICROSD  74.4,76.9 180 top
MOV1  33.5,8.5 135 top
MOV2  38.5,8.5 135 top
MOV3  43.5,8.5 135 top
MOV4  48.5,8.5 135 top
MOV5  53.5,8.5 135 top
MOV6  58.5,8.5 135 top
MOV7  63.5,8.5 135 top
MOV8  68.5,8.5 135 top
MOV9  85.9,7.5 0 top
Q1  33.7,12.6 180 top
Q2  38.7,12.6 180 top
Q3  43.7,12.6 180 top
Q4  48.7,12.6 180 top
Q5  53.7,12.6 180 top
Q6  58.7,12.6 180 top
Q7  63.7,12.6 180 top
Q8  68.7,12.6 180 top
QB1  25.3,19.6 0 top
QB2  32.9,21.5 0 top
QP1  25.9,26.2 0 top
QP2  36.4,21.5 0 top
R0  5.6,26.6 0 top
R1  33.75,15.4 0 top
R2  38.75,15.3 0 top
R3  43.75,15.4 0 top
R4  48.65,15.4 0 top
R5  53.75,15.4 0 top
R6  58.65,15.4 0 top
R7  63.65,15.4 0 top
R8  68.75,15.5 0 top
RAIN  83.55,3.9 0 top
RB  47.8,28.65 90 top
RB1  25.3,16.9 180 top
RB2  29.4,20.5 0 top
RBS  85.9,46 270 top
RC  51.2,44.6 270 top
RCL  63.3,42.9 90 top
RDA  64.8,42.9 90 top
RDC  30,23.3 0 top
REA  96.4,37.8 0 top
REB  96.4,36.1 0 top
RF  54.9,72.4 0 top
RJ45  95,25.5 0 top
ROE  53.4,62.7 90 top
RP1  25.9,23.4 180 top
RP2  36.3,18.5 180 top
RPR  60.9,62.9 90 top
RR  40.2,48 0 top
RR+  82.7,41.9 270 top
RR-  80.9,41.9 90 top
RS  88.2,12 0 top
RSC  29.1,27 90 top
RSD  74.5,63.5 0 top
RT  47.8,25.4 90 top
RT+  86.1,56.4 90 top
RT-  88.2,56.4 270 top
RZ  87.2,15.8 180 top
S12  33.26,3.9 0 top
S34  43.42,3.9 0 top
S56  53.58,3.9 0 top
S78  63.74,3.9 0 top
U$1  3.5,78.5 90 top
U$3  100.5,4.5 0 top
U$4  22.5,82.7 0 top
USB  7.5,36.9 0 top
X  41.5,37.8 0 top
X0  55.4,34.5 180 top
XA  45.7,53 270 top
XE  77.1,55.9 180 top
ZB  50,26.8 90 top
ZS  82.2,14.1 270 top

### Tracks (layer width: path | path; a pad name or v marks a point on that pad's centre or on a via)
A0  (via drill 0.3)
  Top 0.203: v56.96,61.15 56.86,61.05 56.86,59.34 ATMEGA.37 | v64.29,72.87 v61.34,69.91
  Bottom 0.203: v56.96,61.15 56.29,61.82 56.29,64.87 v61.34,69.91 | v64.29,72.87 64.29,73.34 65.15,74.2 87.92,74.2 97.92,64.2 99.44,64.2 99.73,63.91 B1.1
A1  (via drill 0.3)
  Top 0.203: v66.86,72.87 65.53,74.2 62.48,74.2 57.63,69.34 57.63,59.34 ATMEGA.36
  Bottom 0.203: v66.86,72.87 79.34,72.87 98.39,53.82 99.73,53.82 B2.1
A2  (via drill 0.3)
  Top 0.203: v65.34,73.53 62.39,73.53 58.48,69.63 58.48,59.34 ATMEGA.35
  Bottom 0.203: v65.34,73.53 79.25,73.53 97.82,54.96 100.3,54.96 100.97,54.29 100.97,44.77 99.82,43.62 B3.1
A3  (via drill 0.3)
  Top 0.203: v62.58,72.87 59.24,69.53 59.24,59.34 ATMEGA.34 | v58.58,76.58 55.63,76.58 52.39,73.34 52.39,72.48 RF.1
  Bottom 0.203: v62.58,72.87 62.29,72.87 v58.58,76.58
A4  (via drill 0.3)
  Top 0.203: ATMEGA.33 v61,58.3 61,62.1 60.9,62.1 RPR.1
  Bottom 0.305: EXTOUT.3 95.6,10.9 93.8,10.9 79.5,25.2 79.5,33.6 79.9,34 79.9,38.6 ATMEGA.33 v61,58.3
A5  (via drill 0.3)
  Top 0.203: v54.29,56.77 60.96,56.77 ATMEGA.32
  Bottom 0.203: v54.29,56.77 44.39,56.77 43.43,55.82 43.05,55.82 32.58,66.29 32.58,71.82 JP2.13
A6  (via drill 0.3)
  Top 0.203: v59.44,56.1 59.63,55.91 60.96,55.91 ATMEGA.31 | v52.01,64.48 52.01,67.15 42.96,76.2 30.29,76.2 28.96,74.87 28.96,73.91 29.62,73.25 31.43,73.25 32.48,74.3 JP2.14
  Bottom 0.203: v59.44,56.1 59.44,57.05 v52.01,64.48
A7  (via drill 0.3)
  Top 0.203: RZ.2 86.5,15.75 82.25,15.75 ZS.C v79,19 | v62.25,55.25 62.12,55.12 61,55.12 ATMEGA.30
  Bottom 0.203: v62.25,55.25 62.25,54.75 79,38 v79,19
AREF
  Top 0.305: C4.1 62.4,54.5 62.2,54.3 ATMEGA.29
BOOST_V
  Top 0.61: D3.C 40.7,26.6 41.5,26.6 44.4,23.7 CB.+ 44.56,23.38 | 44.56,23.38 44.7,23.8 45.5,24.6 47.8,24.6 RT.1 48.1,24.6 49,24.6 49.5,25.1 ZB.C | 37.4,20.4 37.4,19.2 37.2,19 37.2,18.5 RP2.1 | 37.4,20.4 QP2.2 | 37.4,20.4 41.58,20.4 44.56,23.38
COM  (via drill 0.3)
  Top 0.61: COM.1 COM.2 24.07,3.9 D4.C | QP2.3 v35.4,22.6
  Bottom 0.61: v35.4,22.6 31.5,22.6 18.6,9.7 18.6,3.9 COM.2
D0
  Top 0.203: ATMEGA.40 54.48,59.24 54.48,58.58 54.86,58.2 59.53,58.2 60.01,58.67 60.01,64.39 60.67,65.06 73.15,65.06 73.3,65.1
  Top 0.305: RSD.1 73.7,63.5 73.7,64.7 73.3,65.1 73.3,66.4 MICROSD.2
D1  (via drill 0.3)
  Top 0.203: ROE.1 53.4,61.9 53.5,61.9 53.6,61.8 ATMEGA.41 53.63,59.24 53.63,56.01 v58.29,51.34 | v58.77,40.58 v58.77,44.1 | 74HC595.13 60.1,27.62 v60.1,30.29 60.12,30.25 63.12,30.25 63.75,29.62 76.88,29.62 91.62,14.88 94.12,14.88 EXTOUT.8
  Bottom 0.203: v58.29,51.34 59.05,51.34 59.53,50.86 59.53,47.34 58.77,46.58 v58.77,44.1 | v58.77,40.58 58.77,38.48 60.39,36.86 60.39,30.57 v60.1,30.29
D3  (via drill 0.3)
  Top 0.203: ATMEGA.43 52,60.88 v50.25,62.62 | v50.25,71.62 50.25,72.62 55.62,78 95.88,78 101.38,72.5 101.38,43.38 96.38,38.38 96.38,32.88 97.25,32 97.25,16.88 95.38,15 95.38,13.5 94.25,12.38 EXTOUT.6 92.5,14 91.88,14 77,28.88 63.88,28.88 63,29.75 62.5,29.75 61.5,28.75 61.5,27.62 74HC595.12
  Bottom 0.203: v50.25,71.62 v50.25,62.62
D4  (via drill 0.3)
  Top 0.203: v79.44,46.48 79.34,46.39 79.34,45.15 ENC28J60.9 | v44.67,71.25 44.67,65.82 51.15,59.34 ATMEGA.44
  Bottom 0.203: v79.44,46.48 78.87,45.91 77.06,45.91 62.67,60.29 62.67,69.44 57.44,74.68 48.1,74.68 v44.67,71.25
D12  (via drill 0.3)
  Top 0.203: v47.34,45.15 47.34,45.24 50.86,48.77 51.53,48.77 51.91,48.39 51.91,47.72 ATMEGA.13 | v42.96,45.15 42.58,44.77 40.48,44.77 40.2,45.05 40.2,71.82 JP2.19
  Bottom 0.203: v42.96,45.15 v47.34,45.15
D13  (via drill 0.3)
  Top 0.203: v38.58,42.01 39.05,42.01 40.2,40.86 40.2,39.34 39.62,38.77 39.62,36.86 39.91,36.58 43.15,36.58 43.34,36.77 43.34,37.43 50.39,44.48 51.82,44.48 52.77,45.43 52.77,47.62 ATMEGA.14 | v36.2,49.05 36.2,68.86 39.05,71.72 39.05,73.25 40.1,74.3 JP2.20
  Bottom 0.203: v38.58,42.01 38.58,46.67 v36.2,49.05
D14  (via drill 0.3)
  Top 0.203: v52.96,48.96 53.53,48.39 53.53,47.72 ATMEGA.15
  Bottom 0.203: v52.96,48.96 46.86,48.96 45.53,47.62 38.48,47.62 29.15,56.96 29.05,56.96 27.53,58.48 27.53,71.82 JP2.9
D15  (via drill 0.3)
  Top 0.203: v53.44,46.1 54.39,47.05 54.39,47.62 ATMEGA.16 | v44.77,46.1 43.05,44.39 38.29,44.39 37.72,44.96 v37.72,46.67
  Bottom 0.203: v44.77,46.1 v53.44,46.1 | v37.72,46.67 26.38,58.01 26.38,73.25 27.43,74.3 JP2.10
D18
  Top 0.203: ATMEGA.21 58.39,47.72 58.39,50.29 50.1,58.58 50.1,59.82 42.77,67.15 42.77,71.82 JP2.21
D19  (via drill 0.3)
  Top 0.203: v58.86,50.67 59.15,50.39 59.15,47.72 ATMEGA.22 | v47.05,48.29 44.39,48.29 43.24,49.43 v43.24,56.48
  Bottom 0.203: v58.86,50.67 55.53,50.67 53.15,48.29 v47.05,48.29 | v43.24,56.48 43.24,56.77 36.58,63.44 36.58,72.29 37.53,73.25 41.62,73.25 42.67,74.3 JP2.22
D20  (via drill 0.3)
  Top 0.203: v23.62,15.91 24.96,15.91 25.91,16.86 26.1,16.86 RB1.1 | v59.72,36.67 61.72,36.67 v61.82,36.77 | v62.1,48.77 61.82,48.77 61.05,49.53 ATMEGA.23
  Bottom 0.203: v23.62,15.91 23.91,15.91 35.15,27.15 44.96,27.15 54.48,36.67 v59.72,36.67 | v61.82,36.77 61.82,48.48 v62.1,48.77
D21
  Top 0.203: ATMEGA.24 61.05,50.29 61.63,50.29 69.15,42.77 69.15,36.86 68.48,36.2 63.25,36.2 62.01,37.43 57.63,37.43 56.2,36 56.2,31.81 57.24,30.77 58.1,30.77 58.86,30 58.86,27.62 74HC595.14
D22  (via drill 0.3)
  Top 0.203: v65.25,47.5 61.75,51 61,51 ATMEGA.25 | v62.75,29.12 62.75,27.62 74HC595.11
  Bottom 0.203: v65.25,47.5 65.25,38.38 62.75,35.88 v62.75,29.12 66.25,29.12 77,18.38 83.88,18.38 92.5,9.75 94.12,9.75 EXTOUT.4
D23  (via drill 0.3)
  Top 0.203: v34,21.62 29.91,21.62 28.86,20.57 28.57,20.57 RB2.1 | v56.86,32 57.15,32 57.91,31.24 v61.63,31.24 | v62.29,51.34 61.82,51.82 61.05,51.82 ATMEGA.26
  Bottom 0.203: v34,21.62 40.48,21.62 50.86,32 v56.86,32 | v61.63,31.24 61.63,36.1 61.15,36.58 61.15,50.2 v62.29,51.34
D+  (via drill 0.3)
  Top 0.203: v37.81,38.29 37.81,39.05 38.29,39.53 38.29,40.1 CH340.5 | v12.86,38.29 11.53,39.62 8.95,39.62 7.53,38.2 USB.D+
  Bottom 0.203: v12.86,38.29 v37.81,38.29
D-  (via drill 0.3)
  Top 0.203: v38.58,38.96 39.53,39.91 39.53,40.1 CH340.6 | v11.34,38.96 10.29,38.96 9.53,38.2 USB.D-
  Bottom 0.203: v11.34,38.96 v38.58,38.96
DCIN
  Top 0.61: D0.C 8.7,28.3 7.8,27.4 R0.2 7.8,25.2 12,21 12.3,20.9 14,20.9 15.2,19.7 15.2,17.8 18.6,14.4 18.6,9.7 20,8.3 20.3,8.3 20.4,8.2 20.4,7.6 D1.A
DCIN_PRE  (via drill 0.3)
  Top 0.61: J.3 1.9,53.3 4.2,51 4.2,48.9 0.6,45.3 0.6,30.6 3.4,27.8 R0.1 3.4,25.7 v4.4,24.7 | v14.4,12.1 14.8,12.1 15.9,11 D2.C 16.2,10.6 16.2,10.2 16.3,10.1 16.6,10.1 18.7,8 18.7,5.9 19,5.8 19.1,5.7 21.9,5.7 22.6,6.4 25.5,6.4 27.7,4.1 D4.A | QP1.2 26.9,25.1 26.9,24.6 26.8,24.5 26.8,23.4 RP1.1 26.8,23.1 26.8,22.9 v26.2,22.3
  Bottom 0.61: v26.2,22.3 16.1,12.2 14.7,12.2 v14.4,12.1 14.1,12.1 13.5,11.5 8.4,11.5 6.4,13.5 6.4,15.5 7.8,16.9 7.8,21.3 v4.4,24.7
GND  (via drill 0.3)
  Top 0.203: 34063.4 37.7,29.4 38,29.4 39.1,30.5 40.2,30.5 CT.2 40.29,30.48 44.39,30.48 CB.- | 31.24,42.1 31.24,44.1 C10.1 | 31.24,42.1 33.24,40.1 CH340.1 | 31.24,42.1 15.43,42.1 14.48,41.15 14.48,37.91 | 16.59,35.79 14.48,37.91 | 14.48,37.91 14.38,37.91 13.43,36.96 9.14,36.96 7.91,35.72 7.53,35.72 USB.GND 7.43,35.62 7.43,30.77 6.29,29.62 6.29,18.38 J1.GND | 18.57,27.2 18.57,21.53 7805.3 | 44.01,57.05 44.01,49.24 44.2,49.05 45.53,49.05 46.29,49.82 46.48,49.82 CA1.2 | 44.01,57.05 44.2,57.24 45.72,57.24 46.48,56.48 CA0.2 46.67,56.39 47.43,55.63 47.43,54.86 48.77,53.53 49.34,53.53 ATMEGA.6 | 73.25,54.96 72.01,54.96 70.29,53.24 70.29,51.62 71.06,50.86 C12.2 | 73.25,54.96 74.01,54.96 CE0.2 | ENC28J60.22 78.01,52.48 78.58,52.48 ENC28J60.21 78.58,52.58 78.58,53.24 79.72,54.39 80.2,54.39 | 80.2,54.39 80.2,54.29 80.58,53.91 80.58,52.48 ENC28J60.18 | 80.2,54.39 80.2,54.96 CE1.2 80.3,55.05 80.3,55.34 82.11,57.15 82.11,57.63 | 55.91,64.39 55.91,70.87 57.34,72.29 RF.3 | 55.91,64.39 55.91,63.72 C5.2 | 55.91,64.39 52.77,64.39 52.48,64.1 52.48,62.96 52.67,62.77 54.01,62.77 54.29,62.48 54.29,62.1 55.15,61.24 55.15,59.34 ATMEGA.39 | 82.11,62.67 82.11,66.96 MICROSD.GND1 | 82.11,62.67 82.11,57.63 | 73.25,54.96 73.25,57.44 73.44,57.63 82.11,57.63 | v43.81,57.05 44.01,57.05 | CB.- 44.48,30.48 45.43,29.53 47.72,29.53 RB.2 47.82,29.43 49.05,29.43 49.91,28.57 ZB.A 50.1,28.48 51.44,29.81 54.96,29.81 C9.2 55.15,29.91 55.15,35.62 57.96,38.43 | ATMEGA.18 56.01,47.62 56.01,46.2 56.86,45.34 56.86,39.53 C8.2 56.96,39.43 57.96,38.43 | 64.67,36.67 63.34,36.67 62.01,38.01 58.39,38.01 57.96,38.43
  Top 0.203: 64.67,36.67 67.06,36.67 67.53,37.15 67.53,37.53 24AA.2 | v64.67,35.53 64.67,33.24 DS1307.4 | v64.67,36.86 64.67,36.67 | v62.58,53.53 62.58,53.6 | 92.2,55.63 97.16,55.63 98.44,56.91 | 92.2,55.63 90.77,55.63 C7.1 | 98.44,56.91 99.73,58.2 B2.2 99.82,58.29 100.97,59.44 100.97,64.39 99.82,65.53 99.82,68.39 B1.2 | 98.44,56.91 100.97,54.39 100.97,53.24 99.82,52.1 99.82,48.1 B3.2 | 76.01,17.81 BAT.P$1 | 88.2,7.62 MOV9.2 | RBS.1 85.92,46.86 85.92,46.67 92.01,40.58 92.01,33.53 RJ45.SHIELD0 | v71.91,41.72 72.48,41.72 72.96,41.24 CV.2 | 82.11,62.67 91.82,62.67 92.2,62.29 92.2,55.63 | 1117.1 21.05,38.77 24.1,35.72 24.1,20.29 24.86,19.53 25.34,19.53 26.19,18.67 QB1.2 | X.2 41.5,40.88 41.62,41 42.62,41 43.5,40.12 v43.5,39 | v43.5,35.38 43.5,30.5 CB.- | U$4.3 23.72,80.11 22.38,78.77 22.38,74.39 JP2.6 22.29,74.3 21.24,74.3 19.91,72.96 16.19,72.96 7.05,63.82 7.05,63.15 LCD.1.GND
  Top 0.254: JP2.17 37.6,71.9 35.1,71.9 JP2.15
  Top 0.305: ATMEGA.28 62.2,53.5 62.3,53.6 62.58,53.6 64,53.6 64.9,54.5 C4.2 64.7,54.1 65.1,53.7 65.1,52.5 C3.2 | 78.9,43.4 79,43.5 79.7,43.5 80.6,44.4 80.6,45.1 ENC28J60.11 80.6,45.2 80.6,45.9 81.7,47 RBS.1 | C6.1 78.9,43.4 | 75.6,43.5 74.7,44.4 74.7,45.1 ENC28J60.2 | 75.6,43.5 78.8,43.5 78.9,43.4 | CV.2 73.9,41.2 75.5,42.8 75.5,43.4 75.6,43.5 | RF.3 57.5,72.4 61.6,76.5 MICROSD.P$1 67.55,75.6 MICROSD.GND3 70.4,66.9 71.4,67.9 77.3,67.9 77.7,67.5 77.7,67.4 77.9,67.2 | MICROSD.P$2 82.15,67.9 | 82.15,67.9 MICROSD.GND1 | 77.9,67.2 78.6,67.9 82.15,67.9 | 77.9,67.2 77.7,67 77.7,66.4 MICROSD.6 | ZS.A 81.5,12.4 76.1,17.8 BAT.P$1 | QB2.2 33.7,20.5 31.8,18.6 QB1.2
  Top 0.61: J1.GND 5.06,15.5 5,15.2 2.3,12.5 2.3,9.2 5.2,6.3 C0.- | C0.- 5.4,6.2 | CH.2 10.9,7.1 6.5,7.1 5.7,6.3 C0.- | BAT.P$1 75.9,19.5 74,21.4 65.3,21.4 74HC595.8 | RAIN.2 88.6,3.9 88.6,7.4 88.5,7.5 MOV9.2 88.4,7.8 85.4,10.8 RS.1 85.1,12.1 84.8,12.4 ZS.A | C1.- 14.4,32.2 15.6,33.4 15.6,34.8 C2.- 15.8,35 16.59,35.79 19.8,39 1117.1 | D0.A 11.2,24.9 14.3,28 14.3,28.3 C1.- | C1.- 15.8,28.6 17.2,27.2 18.57,27.2 22,27.2 CL.2 | 34063.2 37.6,26.9 36.8,26.9 35.9,27.8 35.9,28.4 36.9,29.4 37.6,29.4 34063.4
  Bottom 0.203: LCD.1.GND 6.95,63.05 6.95,62.29 5.24,60.58 5.24,45.24 6.76,43.72 6.76,39.05 6.38,38.67 6.38,36.77 7.43,35.72 USB.GND 7.5,35.5 12.5,30.5 44,30.5 CB.- | 43.81,70.58 48.29,70.58 52.01,74.3 55.63,74.3 57.44,72.48 RF.3 | 43.81,70.58 39.91,70.58 38.67,71.82 37.62,71.82 JP2.17 | 43.81,70.58 v43.81,57.05 | v64.67,35.53 v64.67,36.86 64.67,36.96 67.72,40.01 67.72,41.72 | v62.58,53.53 62.58,51.91 67.72,46.77 67.72,41.72 | 95.73,33.5 95.73,42.96 99.73,46.96 99.73,48.01 B3.2 | v71.91,41.72 67.72,41.72 | v43.5,35.38 v43.5,39
  Bottom 0.305: RJ45.GND 86.2,30 88.6,30 92,33.4 RJ45.SHIELD0 92.1,33.5 95.73,33.5 95.9,33.5 99.7,29.7 99.9,29.7 RJ45.Y- 100,29.5 100,21.5 RJ45.G- 99.9,21.4 96,17.5 | 96,17.5 92.1,17.5 RJ45.SHIELD1 | RAIN.2 94.2,3.9 96.1,5.8 97,5.8 98.1,6.9 98.1,15.4 96,17.5
  pour Top (isolate 0.61): 0,84 104,84 104,0 0,0
  pour Bottom (isolate 0.813): 0,84 104,84 104,0 0,0
INT0
  Top 0.203: ATMEGA.11 49.34,49.43 49.34,49.15 42.86,42.67 38.29,42.67 36.39,40.77 36.39,39.34 36.2,39.15 35.43,39.15 35.15,39.43 35.15,47.15 30,52.29 30,71.82 JP2.11
INT1
  Top 0.305: ATMEGA.12 RC.1
INT2
  Top 0.203: ATMEGA.42 52.77,59.34 52.77,60.96 45.34,68.39 45.34,73.25 42.77,75.82 31.43,75.82 30,74.39 JP2.12
LEDA
  Top 0.305: RJ45.G+ 100,18.9 102.5,21.4 102.5,32.4 97.7,37.2 97.4,37.2 97.3,37.3 97.3,37.8 REA.2
LEDB
  Top 0.305: RJ45.Y+ 99.9,32.2 97.3,34.8 97.3,36.1 REB.2
MISO  (via drill 0.3)
  Top 0.203: 75.53,48.39 77.25,46.67 77.25,45.15 ENC28J60.6 | v75.53,50.1 75.53,48.39 | v75.53,62.2 78.68,65.34 78.68,66.39 MICROSD.7 | v51.34,54.01 51.34,55.91 50.58,56.67 49.44,56.67 ATMEGA.2 | v28.19,62.96 26.19,62.96 17.34,71.82 JP2.1 | v65.25,48.39 75.53,48.39 | v62.48,46.67 61.82,46.67 59.53,48.96 59.53,50.96 v56.48,54.01
  Bottom 0.203: v75.53,62.2 v75.53,50.1 | v28.19,62.96 28.19,58.67 38.86,48.01 45.05,48.01 51.05,54.01 v51.34,54.01 v56.48,54.01 | U$4.5 18.67,80.11 18.67,77.25 16.19,74.77 16.19,72.96 17.24,71.91 JP2.1 | v65.25,48.39 64.2,48.39 v62.48,46.67
MOSI  (via drill 0.3)
  Top 0.203: v76.2,48.58 77.92,46.86 77.92,45.15 ENC28J60.7 | v74.77,65.06 74.77,66.01 74.39,66.39 MICROSD.3 | v52.01,55.82 50.39,57.44 49.44,57.44 ATMEGA.1 | U$4.2 21.14,80.11 21.14,75.63 19.91,74.39 JP2.4 | v58.86,74.68 54.86,74.68 53.82,73.63 v53.82,70.67
  Bottom 0.203: v76.2,48.58 76.2,63.63 v74.77,65.06 68.48,65.06 v58.86,74.68 | JP2.4 19.91,74.39 20.95,75.44 27.91,75.44 28.57,74.77 28.57,69.72 42.86,55.44 43.62,55.44 44.58,56.39 50.86,56.39 51.44,55.82 v52.01,55.82 54.2,55.82 54.96,56.58 54.96,56.96 50.96,60.96 50.96,67.82 v53.82,70.67
N$1
  Bottom 0.61: J1.PWR 0.6,29.7 0.6,45.8 4.2,49.4 4.2,54 1.9,56.3 J.2
N$2
  Top 0.61: QP1.1 25,25.1 25,24.9 25.1,24.8 25.1,23.4 RP1.2 25.1,23.1 25.1,22 25.3,21.8 QB1.3
N$3  (via drill 0.3)
  Top 0.203: v54.67,36 51.24,39.43 51.24,43.53 RC.2
  Top 0.61: RAIN.1 83.5,3.9 83.5,7.4 83.4,7.5 MOV9.1
  Bottom 0.203: v54.67,36 54.67,35.05 57.53,32.19 57.53,29.62 71.72,15.43 77.44,15.43 83.34,9.53 83.34,7.52 MOV9.1
N$4
  Top 0.203: R6.2 59.5,15.7 59.5,18.2 61.4,20.1 61.4,21.4 74HC595.5
  Top 0.61: R6.2 59.5,13.85 Q6.1
N$5
  Top 0.203: R7.2 64.5,15.7 64.5,18.3 62.7,20.1 62.7,21.4 74HC595.6
  Top 0.61: R7.2 64.5,13.85 Q7.1
N$6
  Top 0.203: X.1 40.3,38.7 40.9,39.3 40.9,40.1 CH340.7
N$7
  Top 0.203: R8.2 69.3,15.6 64,20.9 64,21.4 74HC595.7
  Top 0.61: R8.2 69.6,13.75 Q8.1
N$8
  Top 0.203: DS1307.1 60.8,33.3 60.4,33.3 58.2,35.5 58.2,36 X0.1
N$9
  Top 0.61: D3.A 40.7,22.6 39.9,22.6 37.7,24.8 37.7,25.5 34063.1 37.4,25.6 36.9,25.6 35.1,27.4 35.1,28.9 37.8,31.6 L1'.2 38.2,31.9 37.9,31.9 35.5,34.3 L1.P$2
N$10
  Top 0.203: R5.2 54.9,15.5 55.3,15.5 60.2,20.4 60.2,21.4 74HC595.4
  Top 0.61: R5.2 54.6,13.75 Q5.1
N$11
  Top 0.203: 74HC595.3 58.9,21.4 58.9,20.4 55.5,17 52.5,17 51,15.5 49.8,15.5 R4.2
  Top 0.61: R4.2 49.5,13.85 Q4.1
N$12
  Top 0.203: R3.2 44.9,15.5 45.9,15.5 47.8,17.4 54.6,17.4 57.6,20.4 57.6,21.4 74HC595.2
  Top 0.61: R3.2 44.6,13.75 Q3.1
N$13
  Top 0.203: R2.2 39.9,15.4 40.9,15.4 43.3,17.8 53.6,17.8 56.4,20.6 56.4,21.4 74HC595.1
  Top 0.61: R2.2 39.6,13.75 Q2.1
N$14
  Top 0.203: 74HC595.15 57.6,27.5 57.6,26.2 55.4,24 55.4,21.5 52.1,18.2 43.1,18.2 42.3,17.4 38,17.4 36.1,15.5 34.9,15.5 R1.2
  Top 0.61: R1.2 34.6,13.75 Q1.1
N$15
  Top 0.305: CA0.1 44.8,56.4 44.8,55.6 44.9,55.5 44.9,54.1 XA.1 44.8,54 45.8,53 47.2,53 47.5,52.7 ATMEGA.7
N$16
  Top 0.61: Q1.3 32.91,11.5 MOV1.2 31.8,10 31.8,5.3 33.2,3.9 S12.1
N$17
  Top 0.61: Q2.3 37.91,11.5 MOV2.2 36.8,10 36.8,5.4 38.3,3.9 S12.2
N$18
  Top 0.61: Q3.3 42.91,11.5 MOV3.2 41.8,10 41.8,5.5 43.4,3.9 S34.1
N$19
  Top 0.305: CA1.1 44.8,49.9 44.8,50.5 44.9,50.6 45.3,50.6 45.8,51.1 45.8,51.2 46.5,51.9 XA.3 ATMEGA.8
N$20
  Top 0.61: Q4.3 47.91,11.5 MOV4.2 46.8,10 46.8,5.6 S34.2
N$22
  Top 0.61: Q5.3 52.91,11.5 MOV5.2 51.8,10 51.8,5.6 53.5,3.9 S56.1
N$23
  Top 0.61: Q6.3 57.91,11.5 MOV6.2 56.8,10 56.8,5.7 58.6,3.9 S56.2
N$24
  Top 0.61: Q7.3 62.91,11.5 MOV7.2 61.8,10 61.8,5.8 63.7,3.9 S78.1
N$25
  Top 0.61: Q8.3 67.91,11.5 MOV8.2 66.8,10 66.8,5.9 68.8,3.9 S78.2
N$26
  Top 0.61: RDC.1 29.2,23.3 29.2,26.2 29.1,26.2 RSC.1 29.5,26.2 30,26.2 30.7,26.9 31.5,26.9 34063.7 31.8,26.9 32.4,26.9 33.9,28.4 33.9,30.6 31.6,32.9 31.6,34 L1.P$1 32.8,35.52 32.8,37 33.7,37.9 37,37.9 37.96,36.94 L1'.1
N$27
  Top 0.61: 34063.6 31.5,28.1 30.5,28.1 30.3,27.9 29.1,27.9 RSC.2 28.8,27.9 26,27.9 25.9,27.8 QP1.3
N$28
  Top 0.203: 34063.3 37.7,28.1 38.7,28.1 39.3,28.7 40.2,28.7 CT.1
N$29  (via drill 0.3)
  Top 0.203: v42.4,27.8 RB.1 47.82,27.72 47.82,26.29 RT.2 | v33.1,29.2 32.9,29.4 31.6,29.4 34063.5
  Bottom 0.203: v42.4,27.8 34.5,27.8 v33.1,29.2
N$30
  Top 0.203: DS1307.2 62.2,33.2 62.2,32.7 61.2,31.7 59.6,31.7 58.2,33.1 58.1,33 X0.4
N$31
  Top 0.61: RDC.2 30.9,23.3 30.9,25.5 31,25.6 31.5,25.6 34063.8
N$32
  Top 0.61: QB1.1 24.5,18.6 24.5,16.9 RB1.2
N$34
  Top 0.203: ENC28J60.27 74.7,52.4 74.7,51.8 79,47.5 84.7,47.5 85.3,48.1 86.5,48.1 95.6,39 95.6,37.8 REA.1
N$36
  Top 0.203: DS1307.3 63.44,33.15 63.44,32.67 64.2,31.91 72.96,31.91 75.82,34.77 BAT.P$2
N$37  (via drill 0.3)
  Top 0.203: ENC28J60.26 75.4,52.4 75.4,51.7 75.9,51.2 76,51.2 79.3,47.9 83.2,47.9 v83.4,48.1 | v94.6,36.9 95.5,36 95.6,36 95.6,36.1 REB.1
  Bottom 0.203: v94.6,36.9 v83.4,48.1
N$38
  Top 0.61: RP2.2 35.5,18.5 35.5,20.4 QP2.1 35.5,20.7 35.5,21.3 34.2,22.6 QB2.3
N$39
  Top 0.305: CV.1 74.1,44.2 74.1,45.1 ENC28J60.1
N$40
  Top 0.203: X.3 42.7,38.7 42.1,39.3 42.1,40.1 CH340.8
N$41
  Top 0.305: CE0.1 74.1,56.8 74.6,56.8 74.7,56.7 74.7,56.3 75.9,55.1 76,55.1 XE.3 76.1,55.1 76.5,55.1 76.6,55 76.6,54.1 76.7,54 76.7,52.5 ENC28J60.24
N$42
  Top 0.305: CE1.1 80.2,56.8 78.2,56.8 XE.1 78.1,56.9 78,56.8 78,56.7 77.1,55.8 77.1,54.3 77.3,54.1 77.3,52.5 ENC28J60.23
N$43
  Top 0.61: QB2.1 30.4,20.5 30.3,20.6 30.2,20.5 RB2.2
N$54
  Top 0.305: C6.2 78.9,41.1 80.9,41.1 RR-.1 81,41.1 82.7,41.1 RR+.2
N$59
  Top 0.305: RBS.2 82.7,45 82.6,45.1 ENC28J60.14
QH*  (via drill 0.3)
  Top 0.203: v85,16.38 73.88,27.5 65.25,27.5 74HC595.9
  Bottom 0.203: v85,16.38 94.12,7.25 EXTOUT.2
RD+
  Top 0.203: RR+.1 82.7,42.6 86.3,39 86.3,32.2 87.4,31.1 87.4,24.8 88.6,23.6 RJ45.RD+
  Top 0.305: RR+.1 82.7,43 81.9,43.8 81.9,45.1 ENC28J60.13
RD-  (via drill 0.3)
  Top 0.203: v80,41.9 80.8,42.7 RR-.2 | v80.2,33.4 86.1,27.5 RJ45.RD-
  Top 0.305: ENC28J60.12 81.2,45.1 81.2,42.9 81.1,42.8 80.9,42.8 RR-.2
  Bottom 0.203: v80,41.9 80.4,41.5 80.4,33.6 v80.2,33.4
RECDC
  Top 0.61: C0.+ 5.4,10 6.5,8.9 10.9,8.9 CH.1 13.2,8.85 | 13.2,8.85 15.06,8.85 D1.C | 7805.1 15.3,14.2 13.2,12.1 13.2,8.85
RESET  (via drill 0.3)
  Top 0.203: v36.58,46.96 37.34,47.72 37.34,47.91 C11.2 | v80.2,46.86 80.2,46.39 80.01,46.2 80.01,45.15 ENC28J60.10 | v41.72,75.15 41.62,75.06 41.62,67.72 48.29,61.05 48.29,55.53 48.67,55.15 49.34,55.15 ATMEGA.4
  Top 0.305: C11.2 RR.1
  Bottom 0.203: v36.58,46.96 36.58,47.24 22.77,61.05 22.77,71.44 22.38,71.82 JP2.5 22.29,71.91 21.24,71.91 19.91,73.25 19.43,73.25 18.76,73.91 18.76,74.77 21.24,77.25 22.57,77.25 23.72,78.39 U$4.7 23.81,80.11 23.81,78.39 25.81,76.39 27.53,76.39 28.38,75.53 41.72,75.53 | v80.2,46.86 79.92,46.86 79.06,47.72 76.2,47.72 63.06,60.86 63.06,69.63 57.15,75.53 41.72,75.53 | 41.72,75.53 v41.72,75.15
RTS
  Top 0.305: CH340.14 35.8,48 C11.1
RXD  (via drill 0.3)
  Top 0.203: v34.5,41.25 34.5,40.12 CH340.2 | v44.12,39.62 44.12,42.88 50.12,48.88 50.25,48.88 50.5,49.12 50.5,50.62 50.12,51 49.5,51 ATMEGA.9
  Bottom 0.203: v34.5,41.25 36.12,39.62 v44.12,39.62
SCK  (via drill 0.3)
  Top 0.203: v77.25,48.39 78.58,47.05 78.58,45.15 ENC28J60.8 | v77.25,65.06 76.58,65.72 76.58,66.39 MICROSD.5 | v50.67,55.72 50.58,55.82 49.44,55.82 ATMEGA.3 | v28.19,63.82 27.91,63.82 19.91,71.82 JP2.3 | v28.96,76.2 28.96,75.44 28.57,75.06 28.57,68.77 29.34,68.01 v29.34,62.39
  Bottom 0.203: U$4.6 21.14,80.11 21.14,77.72 18.38,74.96 18.38,73.34 19.81,71.91 JP2.3 | v77.25,48.39 v77.25,65.06 75.63,65.06 74.68,66.01 68.39,66.01 58.48,75.91 29.24,75.91 v28.96,76.2 | v50.67,55.72 44.48,55.72 43.81,55.05 36.96,55.05 29.48,62.53 | v28.19,63.82 29.48,62.53 | 29.48,62.53 v29.34,62.39
SCL  (via drill 0.3)
  Top 0.203: DS1307.6 63.4,39.4 63.4,42.1 63.3,42.1 RCL.1 63.25,42.1 62.01,42.1 59.34,44.77 58.58,44.77 56.86,46.48 | 56.86,46.48 56.86,47.62 ATMEGA.19 | U$4.4 26.29,80.11 24.96,78.77 24.96,74.39 JP2.8 24.86,74.3 23.81,73.25 23.81,71.72 22.67,70.58 v22.1,70.58 | v56.77,46.29 56.86,46.39 56.86,46.48
  Top 0.305: DS1307.6 63.4,39.3 63.4,38.8 64.4,37.8 66.6,37.8 66.7,37.7 66.7,37.6 24AA.1
  Bottom 0.203: v22.1,70.58 14.72,63.2 | 14.72,63.2 7.05,55.53 LCD.4.SCL | v56.77,46.29 55.05,46.29 49.05,40.29 37.62,40.29 14.72,63.2
SDA  (via drill 0.3)
  Top 0.203: DS1307.5 64.7,39.4 64.7,42.1 64.8,42.1 RDA.1 64.67,42.2 64.01,42.86 61.82,42.86 58.05,46.62 | 58.05,46.62 57.63,47.05 57.63,47.62 ATMEGA.20 | v26,77.06 26,73.91 24.96,72.87 24.96,71.91 JP2.7 24.96,71.82 28.86,67.91 28.86,62.77 24.19,58.1 | 24.19,58.1 7.05,58.1 LCD.3.SDA | v57.82,46.39 58.05,46.62 | v24.19,58.01 24.19,58.1
  Top 0.305: DS1307.5 64.8,39.3 65.6,39.3 66,38.9 68.3,38.9 68.6,38.6 68.6,37.6 24AA.3
  Bottom 0.203: v26,77.06 26,79.82 26.29,80.11 U$4.8 | v57.82,46.39 57.53,46.39 56.96,46.96 55.15,46.96 48.86,40.67 37.91,40.67 24.19,54.39 v24.19,58.01
SENSE
  Top 0.305: Q1.2 33,13.6 34,12.6 34.3,12.6 34.5,12.4 35.6,12.4 36.8,13.6 37.5,13.6 Q2.2 38,13.6 39,12.6 39.3,12.6 39.5,12.4 40.6,12.4 41.8,13.6 42.5,13.6 Q3.2 43,13.6 44,12.6 44.3,12.6 44.5,12.4 45.6,12.4 46.8,13.6 47.5,13.6 Q4.2 48,13.6 49,12.6 49.3,12.6 49.5,12.4 50.6,12.4 51.8,13.6 52.5,13.6 Q5.2 53,13.6 54,12.6 54.3,12.6 54.5,12.4 55.6,12.4 56.8,13.6 57.5,13.6 Q6.2 58,13.6 59,12.6 59.3,12.6 59.5,12.4 60.6,12.4 61.8,13.6 62.5,13.6 Q7.2 63,13.6 64,12.6 64.3,12.6 64.5,12.4 65.6,12.4 66.8,13.6 67.5,13.6 Q8.2 68,13.6 69,12.6 69.3,12.6 70.2,11.7 70.2,6.8 MOV8.1 70.4,6.6 76.5,0.5 87.3,0.5 92.55,5.75
  Top 0.406: RS.2 91,12.7 87.9,15.8 RZ.1
  Top 0.61: R2.1 37.9,13.85 Q2.2 | R3.1 42.9,13.85 Q3.2 | R4.1 47.8,13.75 Q4.2 | R5.1 52.9,13.85 Q5.2 | R6.1 57.8,13.75 Q6.2 | R7.1 62.8,13.75 Q7.2 | R8.1 67.9,13.85 Q8.2 | Q1.2 32.8,13.8 32.8,14.8 32.9,14.9 R1.1
  Top 1.016: EXTOUT.5 97.03,12.27 98.8,10.5 98.8,6.2 97.5,4.9 93.4,4.9 92.55,5.75 92.3,6 92.3,10.7 RS.2
  Bottom 0.61: MOV1.1 35.4,6.7 36.3,5.8 39.39,5.8 MOV2.1 | MOV2.1 | MOV2.1 41.2,5.8 44.39,5.8 MOV3.1 45.4,6.7 46.3,5.8 49.39,5.8 MOV4.1 50.3,6.5 51,5.8 54.39,5.8 MOV5.1 55.3,6.6 56.1,5.8 59.39,5.8 MOV6.1 | MOV6.1 | MOV6.1 61.2,5.8 64.39,5.8 MOV7.1 65.3,6.6 66.1,5.8 69.39,5.8 MOV8.1 | EXTOUT.5 96.8,12.3 96.8,14.8 EXTOUT.7
TCT  (via drill 0.3)
  Top 0.203: v81.8,48.5 81.8,49.9 83.2,51.3 83.2,54.2 86.1,57.1 RT+.2
  Top 0.305: RT+.2 86.1,57.3 88.2,57.3 RT-.1 88.3,57.3 89.2,57.3 89.3,57.4 90.7,57.4 C7.2 90.8,57.5 L2.1
  Bottom 0.203: v81.8,48.5 81.6,48.3 81.6,29.4 86.1,24.9 RJ45.P4
TD+  (via drill 0.3)
  Top 0.203: v81.2,51.1 81.2,51.4 81.3,51.5 81.3,51.6 81.2,51.7 81.2,52.4 ENC28J60.17 | v83.82,53.34 86.01,55.53 RT+.1
  Bottom 0.203: RJ45.TD+ 88.6,21.1 87.4,22.3 87.4,22.6 86.6,23.4 86.1,23.4 81.2,28.3 v81.2,51.1 81.25,51.15 83.44,53.34 v83.82,53.34
TD-  (via drill 0.3)
  Top 0.203: v80.6,49.3 82.1,50.8 81.9,51 81.9,52.4 ENC28J60.16 81.82,52.48 81.82,55.05 89.06,62.29 91.63,62.29 91.82,62.1 91.82,56.96 91.34,56.48 90.01,56.48 89.15,55.63 88.2,55.63 RT-.2
  Bottom 0.203: v80.6,49.3 80.8,49.1 80.8,28.1 86.1,22.8 86.1,22.4 RJ45.TD-
TXD
  Top 0.203: CH340.3 35.81,40.1 35.81,40.77 39.05,44.01 43.62,44.01 48.29,48.67 48.29,49.82 48.77,50.29 49.34,50.29 ATMEGA.10
VCC  (via drill 0.3)
  Top 0.203: 74HC595.16 56.4,27.6 56.4,29.8 56.5,29.9 C9.1 56.77,29.81 v58.2,29.81 | ATMEGA.38 56,60.7 55.9,60.8 C5.1 | 33.91,39.34 34.48,38.77 36.39,38.77 37.05,39.43 37.05,40.1 CH340.4 37.05,40.2 38.1,41.24 v38.1,41.34 | 33.91,39.34 33.91,45.05 33.34,45.62 CH340.16 | 33.91,39.34 33.81,39.34 31.81,37.34 27.81,37.34 27.34,36.86 1117.4 | JP2.16 35.15,74.39 37.53,74.39 JP2.18 37.72,74.39 38.67,74.39 39.72,75.44 40.58,75.44 41.24,74.77 41.24,60.2 43.62,57.82 43.62,57.72 | 43.62,57.72 41.05,55.15 RR.2 40.96,47.91 40.86,47.81 v40.86,46.96 | 43.62,57.72 46.77,57.72 47.91,56.58 47.91,55.15 48.67,54.39 49.34,54.39 ATMEGA.5 49.44,54.29 50.01,54.29 55.15,49.15 55.15,47.72 ATMEGA.17 55.24,47.62 55.24,39.43 v55.91,38.77 | 82.58,53.72 82.58,55.24 88.68,61.34 90.77,61.34 L2.2 | 82.58,53.72 82.58,52.48 ENC28J60.15 | ENC28J60.28 74.11,52.58 74.11,53.15 74.39,53.44 75.72,53.44 76.01,53.15 76.01,52.48 ENC28J60.25 76.11,52.39 76.11,51.72 76.39,51.44 78.96,51.44 79.25,51.72 79.25,52.39 ENC28J60.20 79.34,52.48 79.92,52.48 ENC28J60.19 79.92,52.58 v79.92,53.72 | 24AA.4 68.48,40.29 68.48,41.53 61.05,48.96 60.1,48.96 59.91,49.15 59.91,52.29 60.29,52.67 60.87,52.67 ATMEGA.27 | 71.91,52.5 71.91,50.2 71.72,50.01 65.91,50.01 65.01,50.91 | 65.01,50.91 63.44,52.48 C3.1 | v82.49,53.72 82.58,53.72 | ROE.2 53.44,63.53 54.29,63.53 55.82,62.01 C5.1 | 65.91,63.72 71.91,63.72 73.06,62.58 74.39,62.58 75.25,63.44 RSD.2 | 65.91,63.72 62.01,63.72 | 62.01,63.72 60.96,63.72 RPR.2 | v56.96,62.01 55.91,62.01 C5.1 | v62.01,63.63 62.01,63.72 | 65.01,50.91 65.91,51.82 65.91,63.72
  Top 0.305: CH340.16 31.2,45.7 C10.2 | C3.1 62.6,52.5 62.4,52.7 ATMEGA.27 | ENC28J60.28 74,52.5 71.91,52.5 71.1,52.5 C12.1 | RSD.2 75.4,63.5 75.4,64.9 75.5,65 75.5,66.4 MICROSD.4 | v64.6,26.1 64,26.7 64,27.5 74HC595.10
  Top 0.61: 1117.4 26.4,36.7 22.7,40.4 16.5,40.4 15.6,39.5 15.5,39.6 C2.+
  Bottom 0.203: v38.1,41.34 38.77,41.34 40.86,43.43 v40.86,46.96 | v79.92,53.72 v82.49,53.72 | v58.2,29.81 59.72,29.81 60.15,29.38 | 60.15,29.38 63.34,26.19 64.48,26.19 v64.6,26.1 | 60.39,62.01 v56.96,62.01 | v62.01,63.63 60.39,62.01 | 60.15,29.38 60.77,30 60.77,41.24 | 60.77,41.24 60.77,57.05 60.39,57.44 60.39,62.01 | v55.91,38.77 56.1,38.77 58.58,41.24 60.77,41.24
  Bottom 0.305: EXTOUT.1 96.7,7.1 94.6,5 93.5,5 88.5,9.5 85.5,9.5 68.4,26.1 v64.6,26.1
VIN  (via drill 0.3)
  Top 0.305: RDA.2 64.8,43.8 63.3,43.8 RCL.2 63.25,43.91 v62.48,44.67 v60.1,47.05 | C8.1 60,39.5 60.1,39.4 60.8,39.4 DS1307.8 60.87,39.53 60.87,39.91 62.01,41.05 v62.48,41.05 | v16.76,34.58 20.67,34.58 1117.3 | U$4.1 18.67,80.11 17.34,78.77 17.34,74.39 JP2.2 17.24,74.3 16.38,74.3 5.71,63.63 5.71,61.91 6.95,60.67 LCD.2.VDD
  Top 0.61: D2.A 20.88,11.55 7805.2 20.9,14.5 20.9,15.6 22,16.7 22,18.8 23.2,20 23.2,28.7 | C1.+ 20.6,28.6 20.7,28.7 22,28.7 CL.1 22.3,28.7 23.2,28.7 | 23.2,28.7 23.2,29.9 21,32.1 21,34.3 1117.3
  Bottom 0.305: 10.67,37.62 9.53,36.48 9.53,35.72 USB.VBUS | 10.67,37.62 10.67,50.1 5.71,55.05 5.71,59.34 6.86,60.48 LCD.2.VDD | 10.67,37.62 13.72,34.58 v16.76,34.58 16.86,34.67 50.86,34.67 60.1,43.91 v60.1,47.05 60.1,57.05 54.96,62.2 54.96,72.39 RF.2 | v62.48,41.05 v62.48,44.67

### Text on the board
tNames: OpenSprinkler v2.3 DC | www.opensprinkler.com | VIN MSI GND SCL D15 IN2 A06 VCC VCC D13 D19 | DAT VIN GND | MSO SCK RST SDA D14 IN0 A05 GND GND D12 D18 | PWR | EXTOUT | S1-8 | RAIN
BoxDim: Serpac WM-032C Enclosure | All units are in inch | Left | Right | Front | Bottom